# EasyEDA Pro project SBS-PCB.eprj

# Schematic Schematic1

## Sheets
1 BUCK: Board Name: Board1; Create Date: 2026-04-30; Page Name: BUCK; Project Name: SBS-PCB; Schematic Name: Schematic1; Update Date: 2026-05-18; Company: EasyEDA.com; Page Size: A4; Version: V1.0
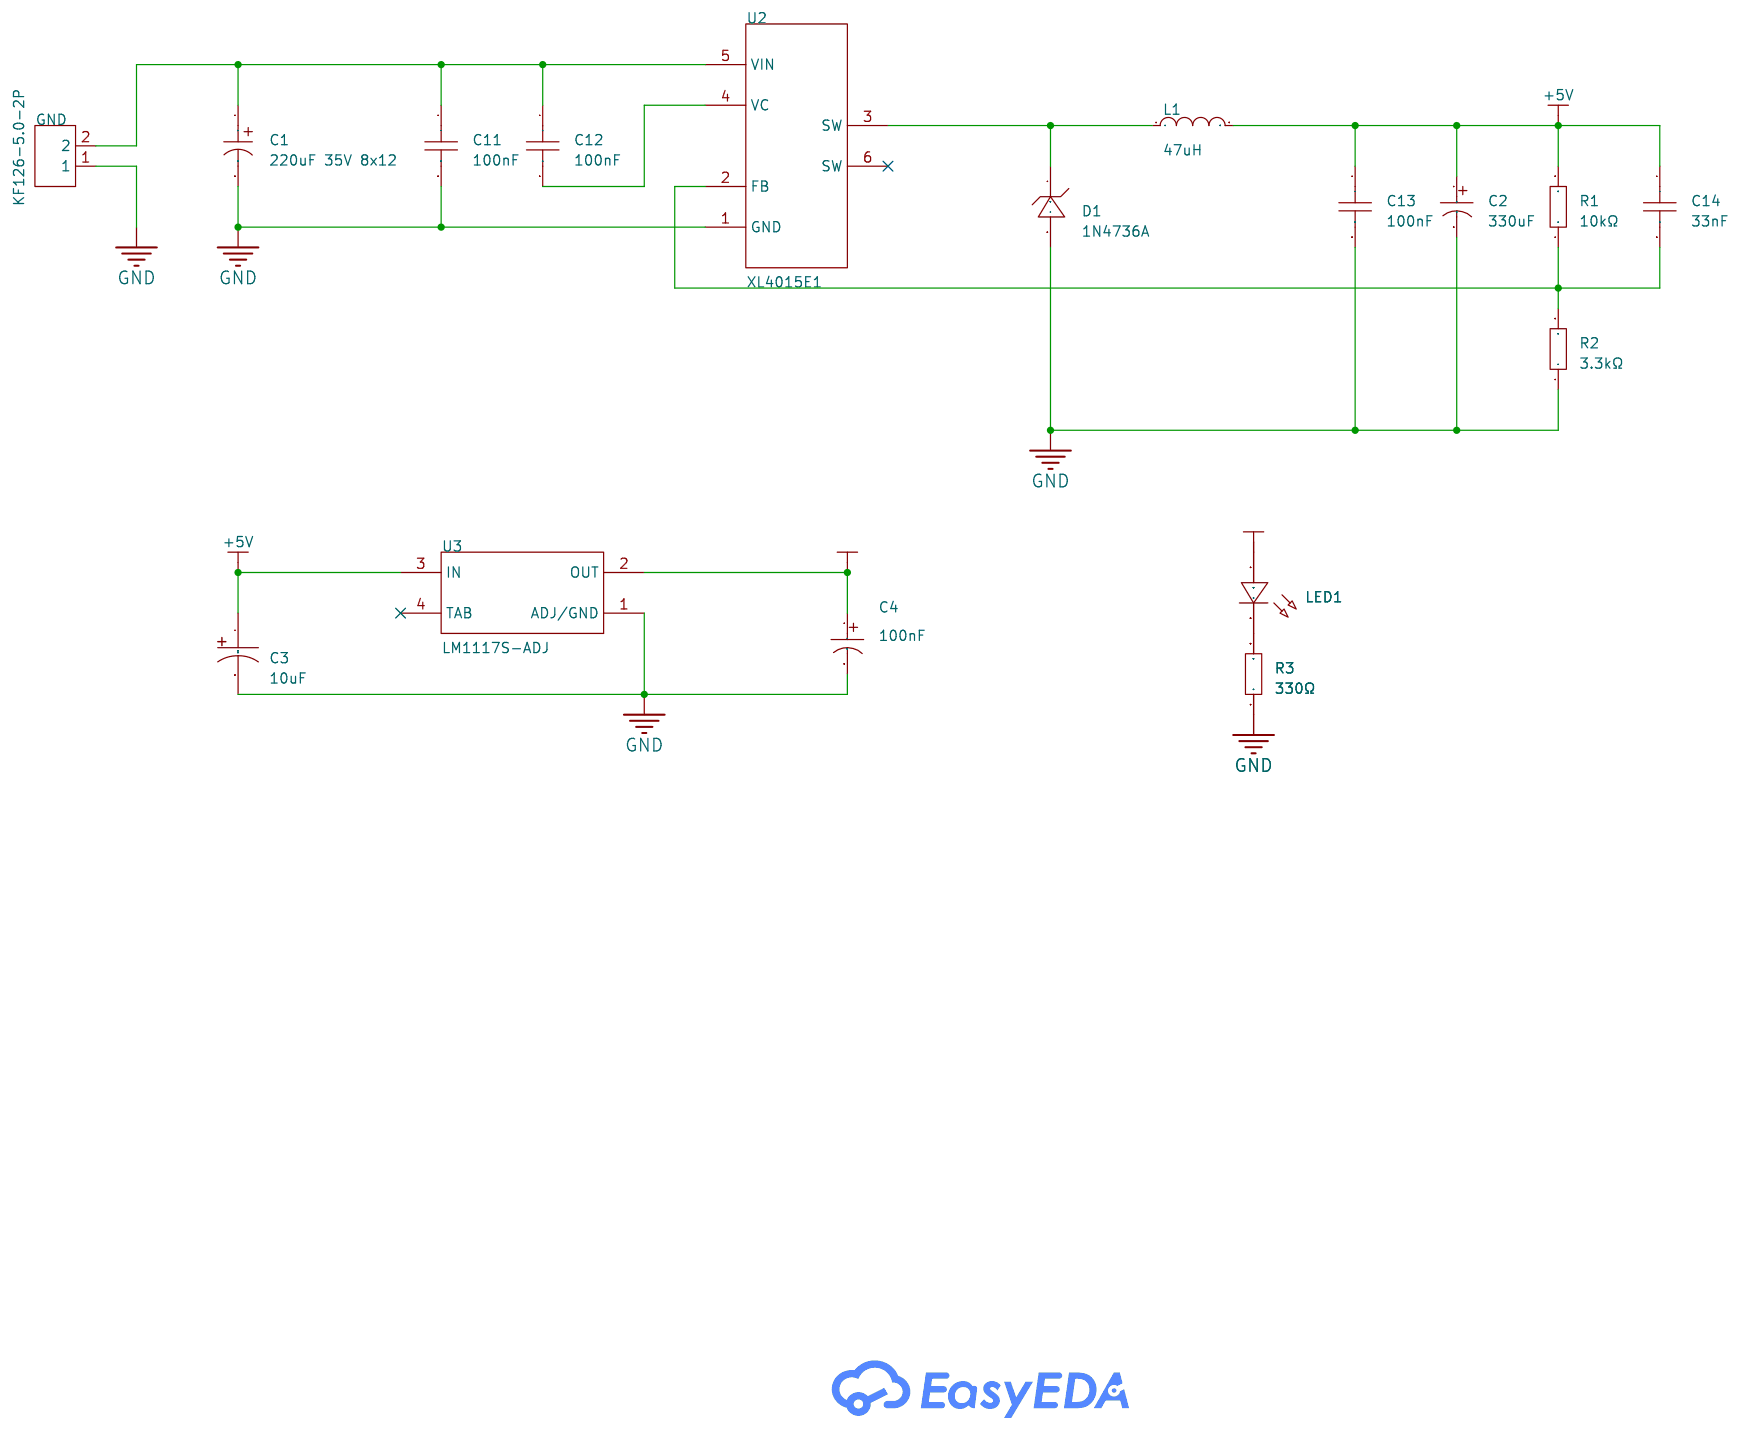
[diagram p0: BUCK]
2 VDK: Page Name: VDK; Update Date: 2026-05-08
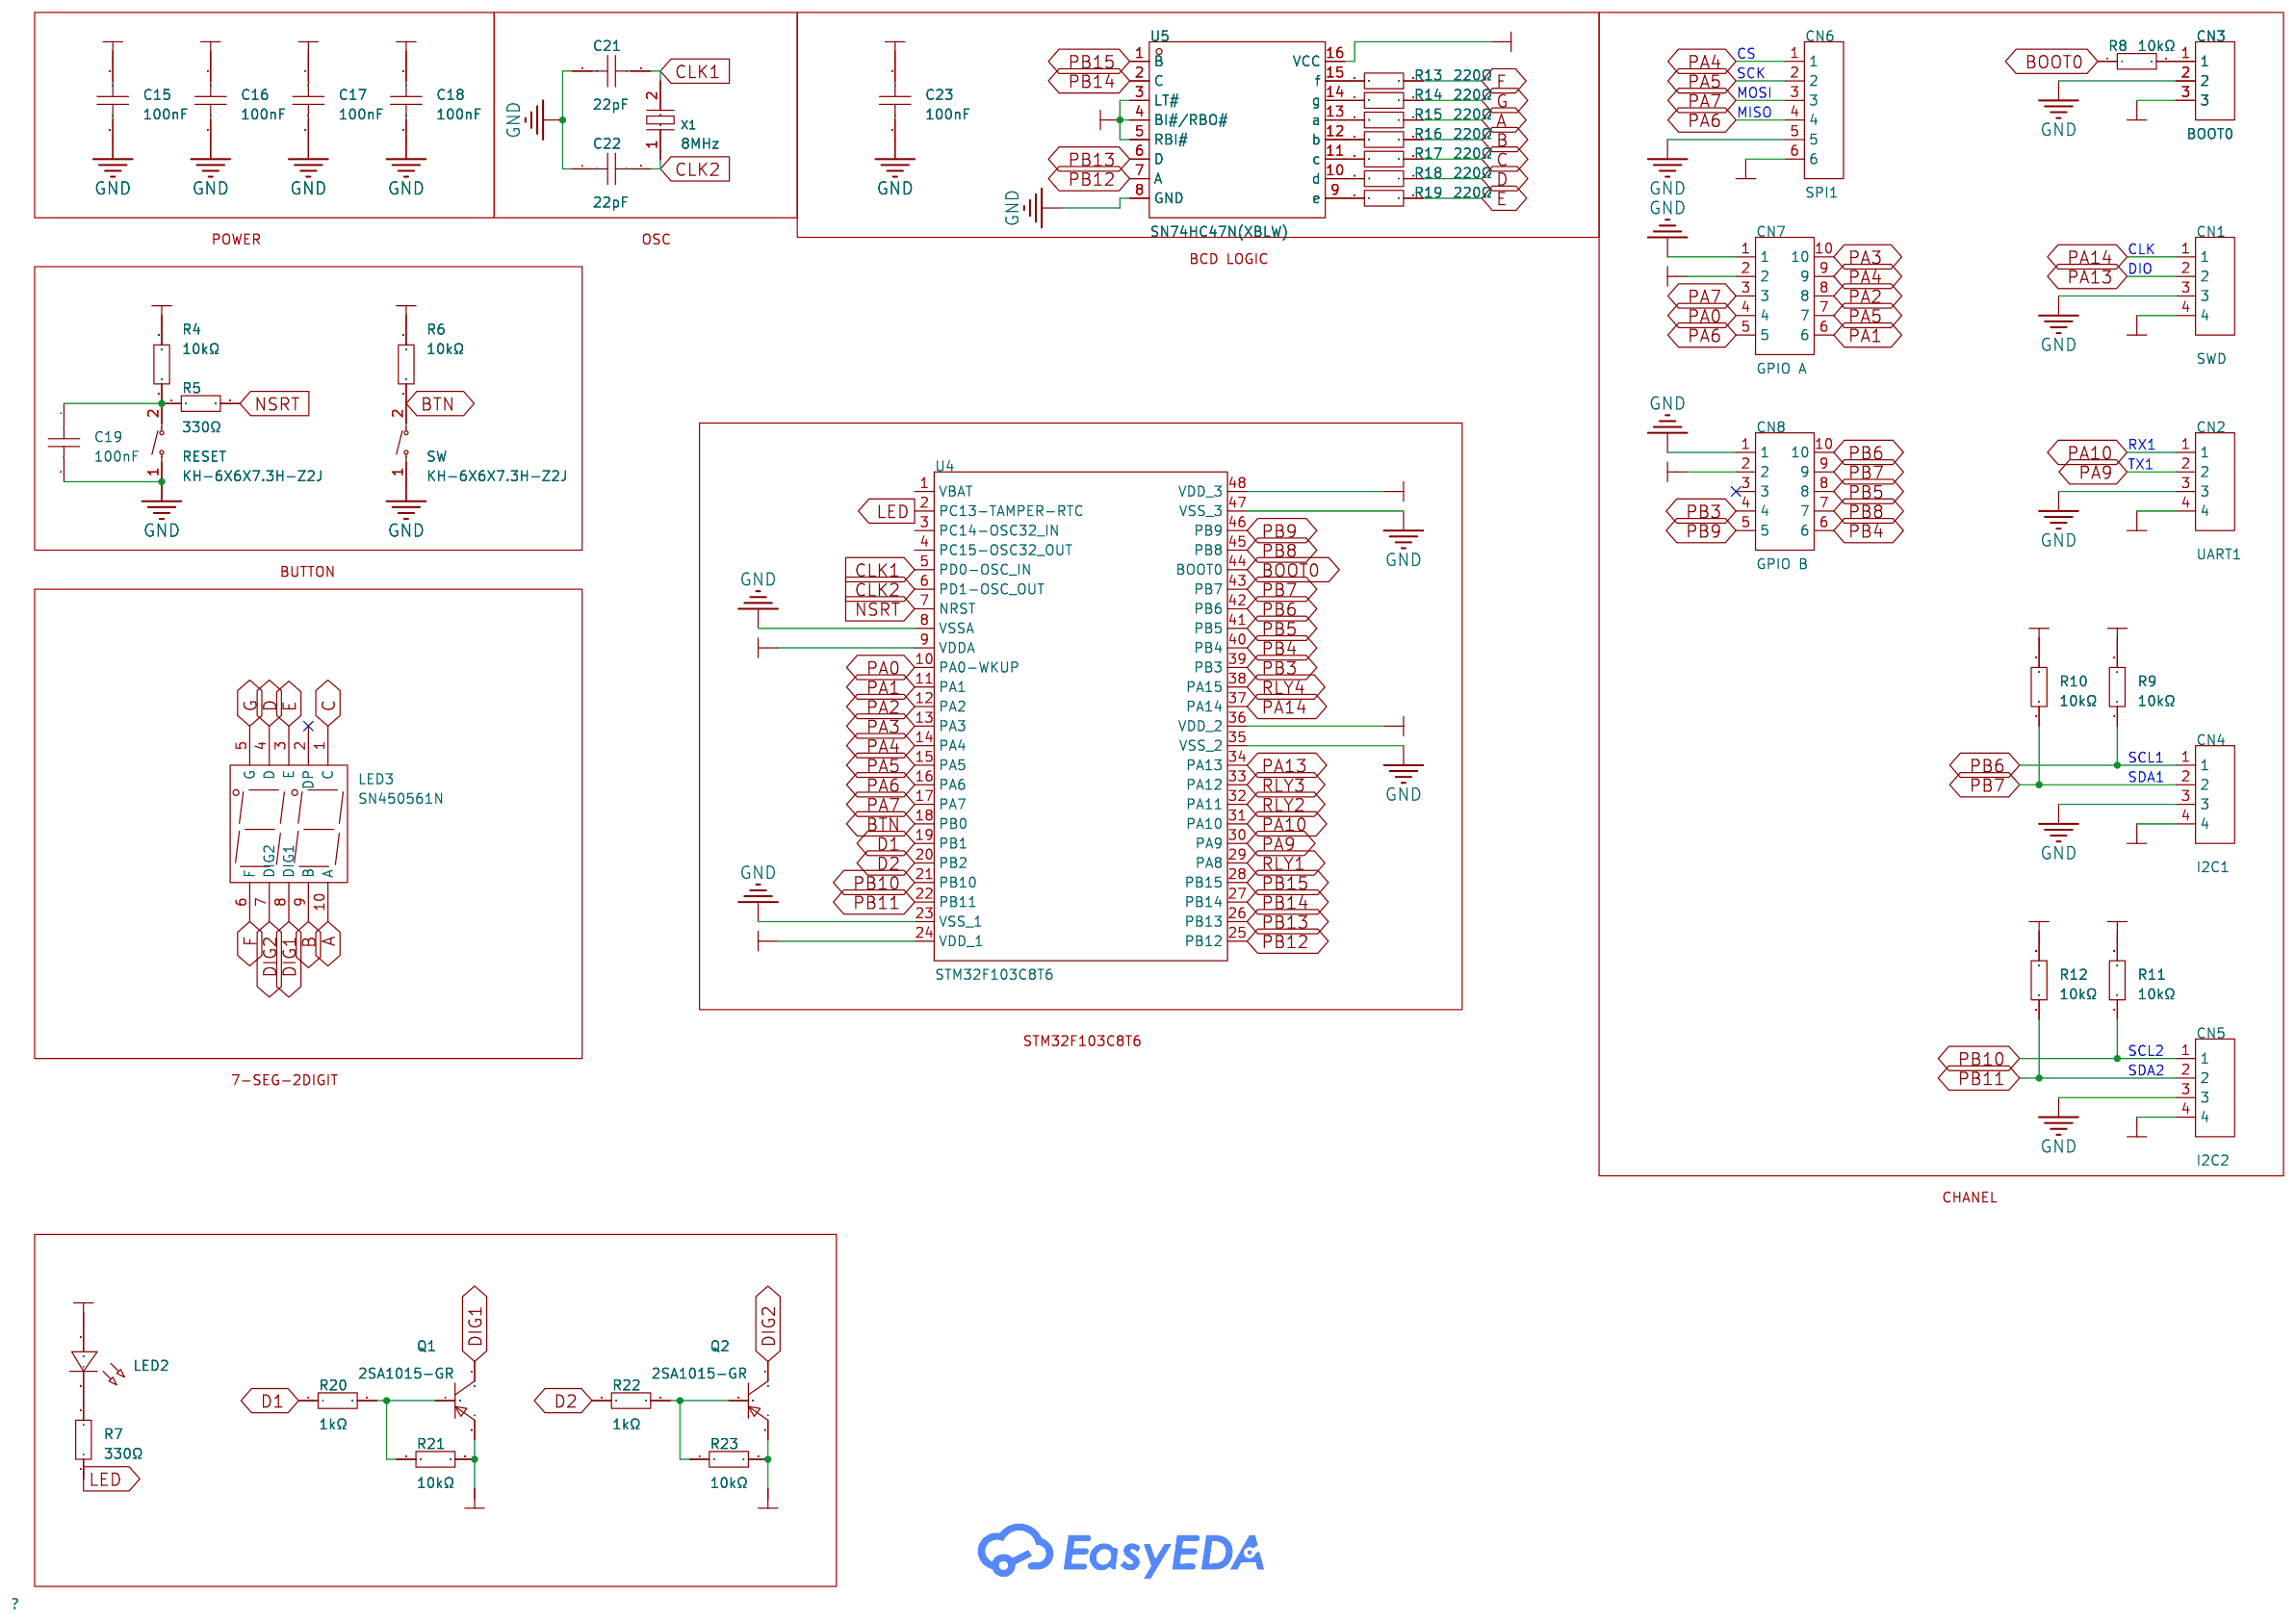
[diagram p1: VDK]
3 RELAY: Page Name: RELAY; Update Date: 2026-05-01
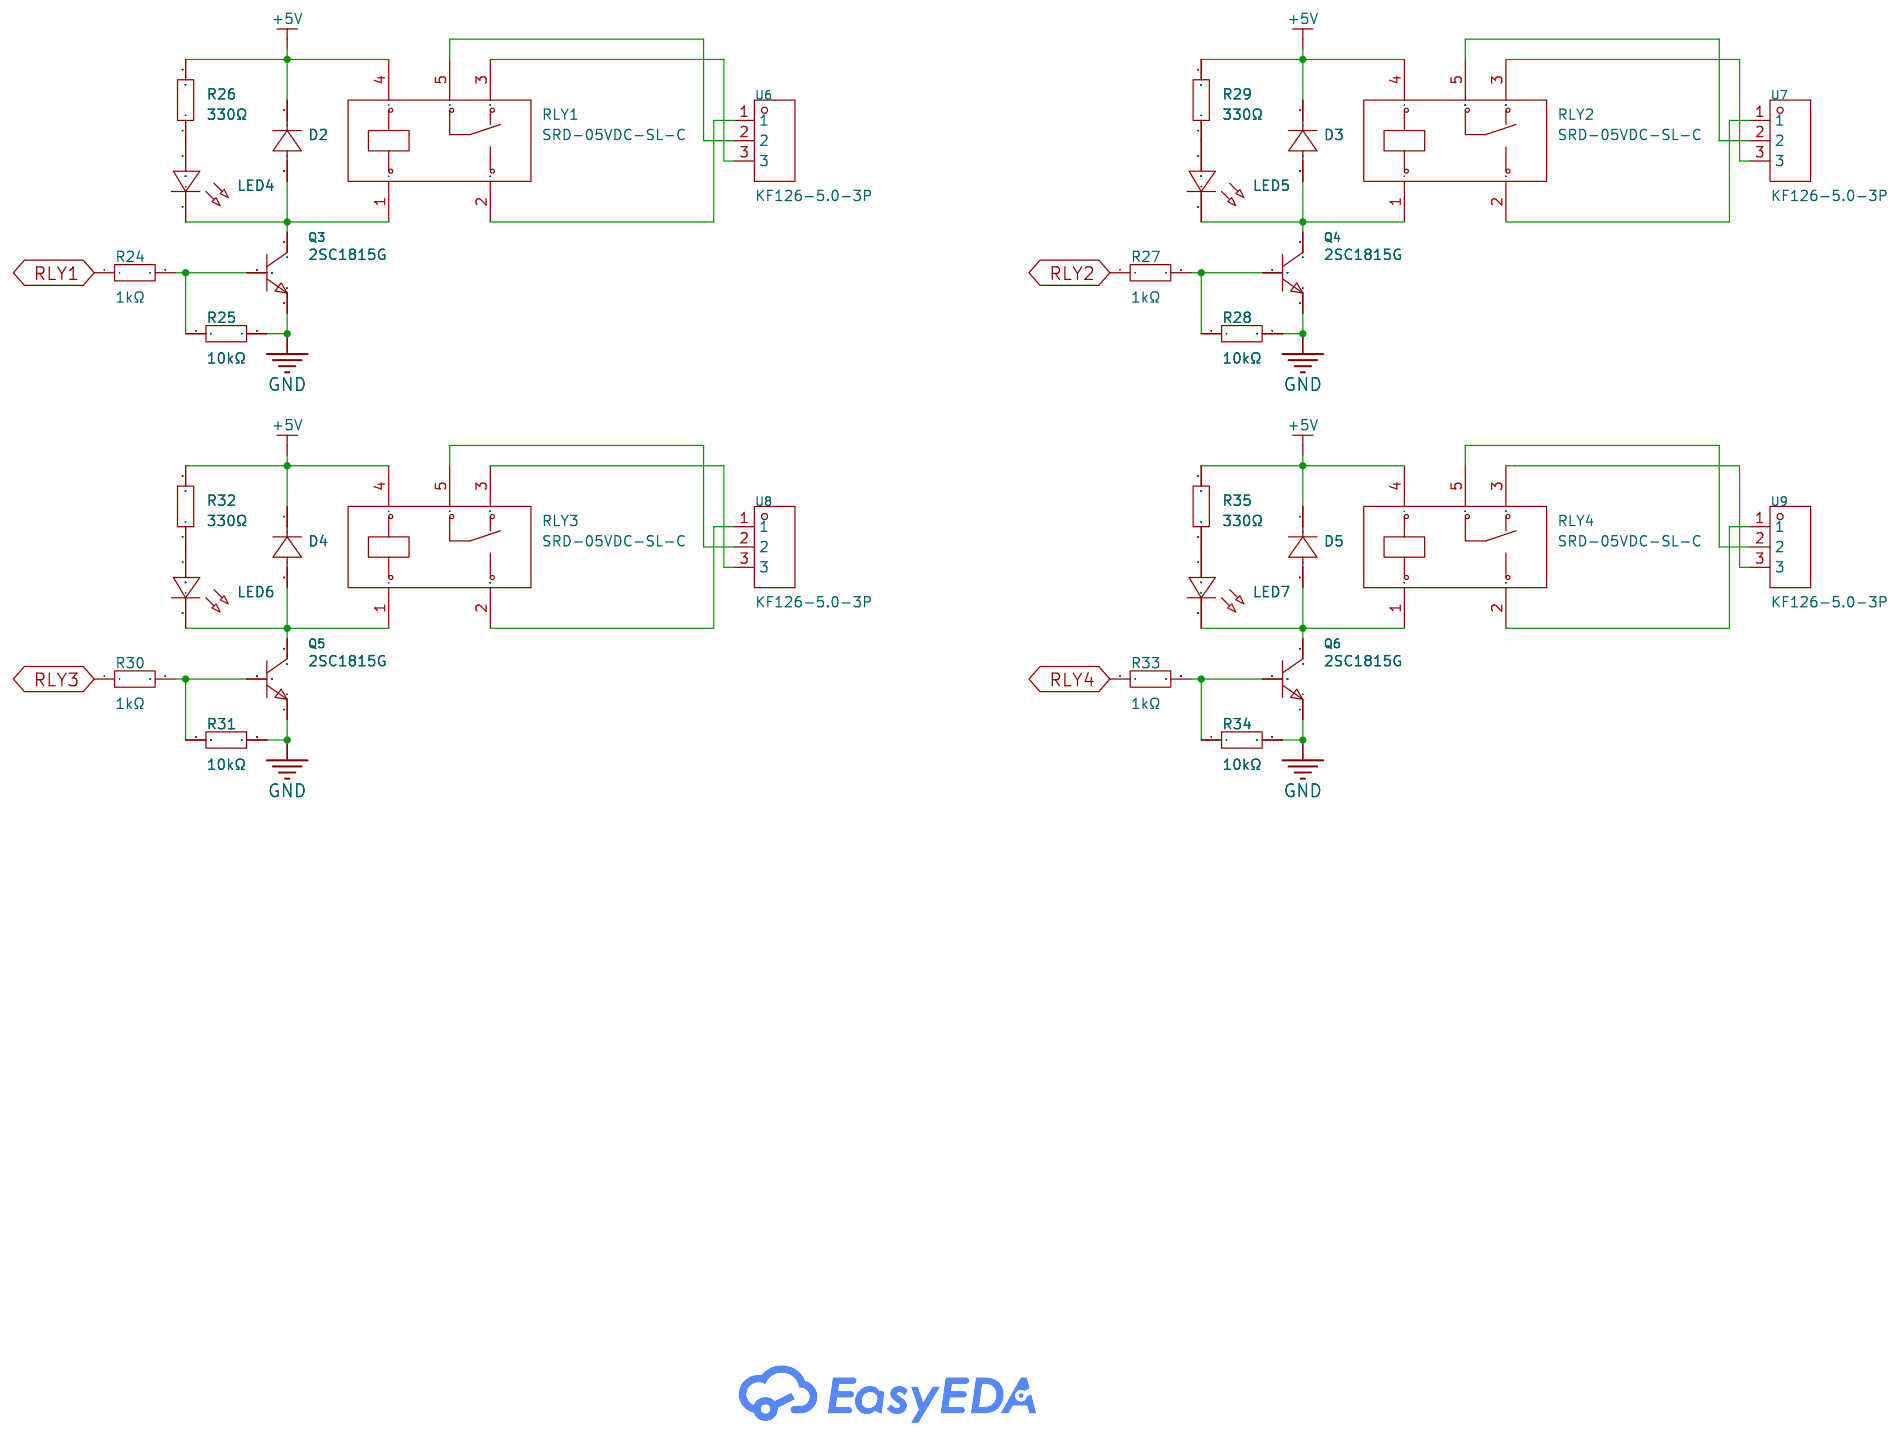
[diagram p2: RELAY]

## Parts
sheet BUCK
C1  220uF 35V 8x12  [CAP-TH_BD8.0-P3.50-D0.5-FD]
C2  330uF  [CAP-TH_BD8.0-P3.50-D0.6-FD]
C3  10uF  [CAP-TH_BD5.0-P2.00-D0.8-FD]
C4  100nF  [CAP-TH_BD5.0-P2.00-D0.8-FD]
C11  100nF  [CAP-TH_L5.0-W2.5-P5.00-D1.0]
C12  100nF  [CAP-TH_L5.0-W2.5-P5.00-D1.0]
C13  100nF  [CAP-TH_L5.0-W2.5-P5.00-D1.0]
C14  33nF  [CAP-TH_L5.0-W2.5-P5.00-D1.0]
D1  1N4736A  [DO-41_BD2.4-L4.7-P8.70-D0.9-RD]
GND  KF126-5.0-2P  [CONN-TH_P5.00_KF126-5.0-2P]
L1  47uH  [IND-TH_L14.5-W7.0-P7.0-D0.6_XR5026T470MVL7]
LED1  -  [LED_TH-3mm]
R1  10kΩ  [Res_1/4W]
R2  3.3kΩ  [Res_1/4W]
R3  330Ω  [Res_1/4W]
U2  XL4015E1  [TO-263-5_L10.2-W8.9-P1.70-TL]
U3  LM1117S-ADJ  [SOT-223-3_L6.5-W3.4-P2.30-LS7.0-BR]
sheet RELAY
D2  -  [DO-41_BD2.4-L4.7-P8.70-D0.9-RD]
D3  -  [DO-41_BD2.4-L4.7-P8.70-D0.9-RD]
D4  -  [DO-41_BD2.4-L4.7-P8.70-D0.9-RD]
D5  -  [DO-41_BD2.4-L4.7-P8.70-D0.9-RD]
LED4  -  [LED_TH-3mm]
LED5  -  [LED_TH-3mm]
LED6  -  [LED_TH-3mm]
LED7  -  [LED_TH-3mm]
Q3  2SC1815G  [TO-92-3_L5.1-W4.1-P1.27-L]
Q4  2SC1815G  [TO-92-3_L5.1-W4.1-P1.27-L]
Q5  2SC1815G  [TO-92-3_L5.1-W4.1-P1.27-L]
Q6  2SC1815G  [TO-92-3_L5.1-W4.1-P1.27-L]
R24  1kΩ  [Res_1/4W]
R25  10kΩ  [Res_1/4W]
R26  330Ω  [Res_1/4W]
R27  1kΩ  [Res_1/4W]
R28  10kΩ  [Res_1/4W]
R29  330Ω  [Res_1/4W]
R30  1kΩ  [Res_1/4W]
R31  10kΩ  [Res_1/4W]
R32  330Ω  [Res_1/4W]
R33  1kΩ  [Res_1/4W]
R34  10kΩ  [Res_1/4W]
R35  330Ω  [Res_1/4W]
RLY1  SRD-05VDC-SL-C  [RELAY-TH_SRD-XXVDC-XL-C]
RLY2  SRD-05VDC-SL-C  [RELAY-TH_SRD-XXVDC-XL-C]
RLY3  SRD-05VDC-SL-C  [RELAY-TH_SRD-XXVDC-XL-C]
RLY4  SRD-05VDC-SL-C  [RELAY-TH_SRD-XXVDC-XL-C]
U6  KF126-5.0-3P  [CONN-TH_3P-P5.00_KF126-5.0-3P]
U7  KF126-5.0-3P  [CONN-TH_3P-P5.00_KF126-5.0-3P]
U8  KF126-5.0-3P  [CONN-TH_3P-P5.00_KF126-5.0-3P]
U9  KF126-5.0-3P  [CONN-TH_3P-P5.00_KF126-5.0-3P]
sheet VDK
C15  100nF  [CAP-TH_L5.0-W2.5-P5.00-D1.0]
C16  100nF  [CAP-TH_L5.0-W2.5-P5.00-D1.0]
C17  100nF  [CAP-TH_L5.0-W2.5-P5.00-D1.0]
C18  100nF  [CAP-TH_L5.0-W2.5-P5.00-D1.0]
C19  100nF  [CAP-TH_L5.0-W2.5-P5.00-D1.0]
C21  22pF  [CAP-TH_L5.0-W2.5-P5.00-D1.0]
C22  22pF  [CAP-TH_L5.0-W2.5-P5.00-D1.0]
C23  100nF  [CAP-TH_L5.0-W2.5-P5.00-D1.0]
CN1  SWD  [CONN-TH_4P-P2.54-XH2.54-LI-4P]
CN2  UART1  [CONN-TH_4P-P2.54-XH2.54-LI-4P]
CN3  BOOT0  [CONN-TH_3P-P2.50_3PIN]
CN4  I2C1  [CONN-TH_4P-P2.54-XH2.54-LI-4P]
CN5  I2C2  [CONN-TH_4P-P2.54-XH2.54-LI-4P]
CN6  SPI1  [CONN-TH_XH2.54-6P]
CN7  GPIO A  [HDR-TH_10P-P2.54-V-M-R2-C5-S2.54]
CN8  GPIO B  [HDR-TH_10P-P2.54-V-M-R2-C5-S2.54]
LED2  -  [LED_TH-3mm]
LED3  SN450561N  [LED-SEG-TH_10P-L25.0-W19.0-P2.54-S15.24-BL]
Q1  2SA1015-GR  [TO-92-3_L4.9-W3.7-P1.27-R]
Q2  2SA1015-GR  [TO-92-3_L4.9-W3.7-P1.27-R]
R4  10kΩ  [Res_1/4W]
R5  330Ω  [Res_1/4W]
R6  10kΩ  [Res_1/4W]
R7  330Ω  [Res_1/4W]
R8  10kΩ  [Res_1/4W]
R9  10kΩ  [Res_1/4W]
R10  10kΩ  [Res_1/4W]
R11  10kΩ  [Res_1/4W]
R12  10kΩ  [Res_1/4W]
R13  220Ω  [Res_1/4W]
R14  220Ω  [Res_1/4W]
R15  220Ω  [Res_1/4W]
R16  220Ω  [Res_1/4W]
R17  220Ω  [Res_1/4W]
R18  220Ω  [Res_1/4W]
R19  220Ω  [Res_1/4W]
R20  1kΩ  [Res_1/4W]
R21  10kΩ  [Res_1/4W]
R22  1kΩ  [Res_1/4W]
R23  10kΩ  [Res_1/4W]
RESET  KH-6X6X7.3H-Z2J  [KEY-TH_L6.2-W6.2-P5.00]
SW  KH-6X6X7.3H-Z2J  [KEY-TH_L6.2-W6.2-P5.00]
U4  STM32F103C8T6  [LQFP-48_L7.0-W7.0-P0.50-LS9.0-BL]
U5  SN74HC47N(XBLW)  [PDIP-16_L19.3-W6.4-P2.54-LS7.94-BL]
X1  8MHz  [HC-49US_L11.0-W4.6-P4.88]

## Library data of the parts
C1 = 220uF35V8x12KM: LCSC Part Name: 220uF ±20% 35V; Supplier Part: C49304872; Manufacturer: Econd(米朗电子); Supplier Footprint: 插件,D8xL12mm; JLCPCB Part Class: Extended Part; Datasheet: https://item.szlcsc.com/datasheet/220uF35V8x12KM/51766700.html; Supplier: LCSC; Tolerance: ±20%; Voltage Rating: 35V; Ripple Current: 300mA@120Hz; Pin Spacing: 3.5mm; Diameter: 8mm; Height - Seated (Max): 12mm; Lifetime: 2000hrs@105℃; Operating Temperature: -40℃~+105℃
C2 = 330uF 25V 8*12: LCSC Part Name: 330uF 25V; Supplier Part: C44590; Supplier Footprint: 插件,8x12mm; JLCPCB Part Class: Extended Part; Supplier: LCSC
C3 = NXA50VB10M5*11_LO: LCSC Part Name: 10uF 50V; Supplier Part: C346966; Supplier Footprint: 插件,5x11mm; JLCPCB Part Class: Extended Part; Supplier: LCSC
C4 = 0.1uF 50V 5*11: LCSC Part Name: 100nF 50V; Supplier Part: C45091; Supplier Footprint: 插件,5x11mm; JLCPCB Part Class: Extended Part; Supplier: LCSC
C11-C19 C21-C23 = 100nF: Supplier Part: C9900015256; JLCPCB Part Class: Extended Part; Supplier: LCSC
D1 = 1N4736A_C261309: Supplier Part: C261309; Manufacturer: TC(德昌); Supplier Footprint: DO-41; JLCPCB Part Class: Extended Part; Datasheet: https://item.szlcsc.com/datasheet/1N4736A/253022.html; Supplier: LCSC; Diode Configuration: Independent; Zener Voltage(Nom): 6.8V; Reverse Leakage Current (Ir): 10uA@4V; Zener Voltage(Range): 6.46V~7.14V; Pd - Power Dissipation: 1W; Impedance(Zzt): 3.5Ω; Impedance(Zzk): 700Ω; Operating Junction Temperature Range: -65℃~+200℃
GND = KF126-5.0-2P: LCSC Part Name: 1x2P 5mm 直插 排数:1 每排P数:2; Supplier Part: C474900; Manufacturer: KEFA(科发); Supplier Footprint: 插件,P=5mm; JLCPCB Part Class: Extended Part; Datasheet: https://item.szlcsc.com/datasheet/KF126-5.0-2P/481518.html; Supplier: LCSC; Number of Positions or Pins: 1x2P; Pitch: 5mm; Color: Green; Mounting Type: Through Hole; Number of Pins: 2P; Number of Rows: 1; Number of PINs Per Row: 2; Current Rating: 18A; Voltage Rating (Max): 250V; Wire Gauge - AWG: 14~26; Wire Gauge - mm2: 2.5; Operating Temperature: -40℃~+105℃
L1 = XR5026T470MVL7: LCSC Part Name: 裸体磁环体积、材质、导感率等参数; Supplier Part: C22358330; Manufacturer: XR(祥如); Supplier Footprint: 插件,D=14.5mm; JLCPCB Part Class: Extended Part; Datasheet: https://item.szlcsc.com/datasheet/XR5026T470MVL7/23794669.html; Supplier: LCSC; Tolerance: ±10%; Current Rating: 4A; Type: Toroidal Inductor; Wire Diameter: 0.7mm
LED1 LED2 = LED_TH-R_3mm: Supplier Footprint: 插件
R1-R35 = Res_AXIAL-1/4W: Supplier Footprint: 轴向引线
U2 = XL4015E1: LCSC Part Name: 5A 180KHz 36V 降压型DC-DC转换器; Supplier Part: C51661; Manufacturer: XLSEMI(芯龙); Supplier Footprint: TO-263-5; Datasheet: https://item.szlcsc.com/datasheet/XL4015E1/52674.html; Supplier: LCSC; Function: Buck; Voltage - Supply: 8V~36V; Output Voltage: 1.25V~32V; Output Current: 5A; Frequency - Switching: 180kHz; Operating Temperature: -40℃~+125℃; Synchronous Rectifier: No; Number of Outputs: 1; Topology: Buck; Quiescent Current: 5mA; Switch tube (built-in/external): Built-in; Output Type: Adjustable
U3 = LM1117S-ADJ: LCSC Part Name: 1A低压差线性稳压器; Supplier Part: C126029; Manufacturer: HTC; Supplier Footprint: SOT-223; JLCPCB Part Class: Extended Part; Datasheet: https://item.szlcsc.com/datasheet/LM1117S-ADJ/137309.html; Supplier: LCSC; Output Type: Adjustable; Voltage - Supply: 12V; Output Voltage: 1.238V~1.281V; Output Current: 1A; Power Supply Rejection Ratio (PSRR): 75dB@(120Hz); Voltage Dropout: 1.2V@(1A); Features: Over Temperature Protection; Operating Temperature: -40℃~+125℃@(Tj); Output Configuration: Positive; Number of Outputs: 1
D2-D5 = 1N4007: Supplier Footprint: DO-41
LED4-LED7 = LED_TH-G_3mm: Supplier Footprint: 插件
Q3-Q6 = 2SC1815G: LCSC Part Name: hfe=200~400 NPN 电流:150mA 电压:50V; Supplier Part: C118545; Manufacturer: ST(先科); Supplier Footprint: TO-92; JLCPCB Part Class: Extended Part; Datasheet: https://item.szlcsc.com/datasheet/2SC1815G/119812.html; Supplier: LCSC; type: NPN; Current - Collector(Ic): 150mA; Collector - Emitter Voltage VCEO: 50V; Pd - Power Dissipation: 400mW; DC Current Gain: 200@2mA,6V; Transition frequency(fT): 80MHz; Current - Collector Cutoff: 100nA; Vce Saturation(VCE(sat)): 250mV@100mA,10mA; Emitter-Base Voltage(Vebo): 5V; Number: 1 NPN
RLY1-RLY4 = SRD-05VDC-SL-C: LCSC Part Name: 蓝色 单组转换型继电器; Supplier Part: C35449; Manufacturer: 松乐; Supplier Footprint: 插件,19.2x15.6mm; JLCPCB Part Class: Extended Part; Datasheet: https://item.szlcsc.com/datasheet/SRD-05VDC-SL-C/36422.html; Supplier: LCSC; Coil Voltage: 5V; Contact Form: One set changeover: 1C (SPDT - changeover); Number of Pins: 5; Switching Voltage(Max): 250V@AC; Coil Rated Power: 360mW; Switching Current(Max): 15A; Coil Type: Non-Polarized - Single Coil; Coil Resistance: 70Ω; Contact Resistance: 100mΩ; Operate Time: 10ms; Release Time: 10ms
U6-U9 = KF126-5.0-3P: LCSC Part Name: 1x3P 5mm 直插 排数:1 每排P数:3; Supplier Part: C474901; Manufacturer: KEFA(科发); Supplier Footprint: 插件,P=5mm; JLCPCB Part Class: Extended Part; Datasheet: https://item.szlcsc.com/datasheet/KF126-5.0-3P/481519.html; Supplier: LCSC; Number of Positions or Pins: 1x3P; Pitch: 5mm; Color: Green; Mounting Type: Through Hole; Number of Pins: 3P; Number of Rows: 1; Number of PINs Per Row: 3; Current Rating: 18A; Voltage Rating (Max): 250V; Wire Gauge - AWG: 14~26; Wire Gauge - mm2: 2.5; Operating Temperature: -40℃~+105℃
CN1 CN2 CN4 CN5 = XHB2.54-4P: Supplier Part: C9900014704; JLCPCB Part Class: Extended Part; Supplier: LCSC
CN3 = 3PIN白色直针插座: Supplier Part: C9900004958; Supplier Footprint: XH2.54MM; JLCPCB Part Class: Extended Part; Supplier: LCSC
CN6 = XH2.54*6P_直插: Supplier Part: C9900008614; Supplier Footprint: XH2.54_6P; JLCPCB Part Class: Extended Part; Supplier: LCSC
CN7 CN8 = Header-Female-2.54_2x5: Supplier Part: C9900010884; JLCPCB Part Class: Extended Part; Supplier: LCSC
LED3 = SN450561N: LCSC Part Name: 2位0.56英寸红色数码管 共阳极; Supplier Part: C193143; Manufacturer: ARKLED(方舟); Supplier Footprint: 插件; JLCPCB Part Class: Extended Part; Datasheet: https://item.szlcsc.com/datasheet/SN450561N/226348.html; Supplier: LCSC; Number of Characters: 2; Digit/Alpha Size(inch): 0.56; Illumination Color: Red; LED Polarity: Common Anode
Q1 Q2 = 2SA1015-GR: Supplier Part: C2844068; Manufacturer: BLUE ROCKET(蓝箭); Supplier Footprint: TO-92-3; JLCPCB Part Class: Extended Part; Datasheet: https://atta.szlcsc.com/upload/public/pdf/source/20210712/C2844068_C347052EB3F495032D45BAB891BF061D.pdf; Supplier: LCSC; type: PNP; Pd - Power Dissipation: 400mW; Current - Collector Cutoff: 100nA
RESET SW = KH-6X6X7.3H-Z2J: LCSC Part Name: 6.2mm*6.2mm*7.3mm 12V 50mA; Supplier Part: C22392358; Manufacturer: kinghelm(金航标); Supplier Footprint: 插件,6.2x6.2mm; JLCPCB Part Class: Extended Part; Datasheet: https://item.szlcsc.com/datasheet/KH-6X6X7.3H-Z2J/23979044.html; Supplier: LCSC; Circuit: SPST; Actuator Style: Round Button; Mounting Type: Through Hole; Length: 6.2mm; Width: 6.2mm; Switch Height: 7.3mm; with Bracket: Without Bracket; Contact Current: 50mA; Voltage Rating: 12V; With Lamp: No; Termination Style: PC Pin; Operating Temperature: -20℃~+70℃
U4 = STM32F103C8T6: LCSC Part Name: 主流增强型ARM Cortex-M3 MCU，具有64 KB Flash、72 MHz CPU、电机控制、USB和CAN; Supplier Part: C8734; Manufacturer: ST(意法半导体); Supplier Footprint: LQFP-48(7x7); JLCPCB Part Class: Extended Part; Datasheet: https://item.szlcsc.com/datasheet/STM32F103C8T6/9243.html; Supplier: LCSC; CPU Core: ARM-M3; CPU Maximum Speed: 72MHz; Program Storage Size: 64KB; Program Memory Type: FLASH; Number of I/O: 37; ADC (Bit): 12bit; Voltage - Supply: 2V~3.6V
U5 = SN74HC47N(XBLW): Supplier Part: C19708132; Manufacturer: XBLW(芯伯乐); Supplier Footprint: DIP-16; JLCPCB Part Class: Extended Part; Datasheet: https://item.szlcsc.com/datasheet/SN74HC47N(XBLW)/21016175.html; Supplier: LCSC; Voltage - Input(DC): 2V~6V; Number of Channels: 7; Output Current: 25mA; Operating temperature: -40℃~+125℃
X1 = ATS080C: LCSC Part Name: 8MHz ±30ppm 32pF; Supplier Part: C1669722; Manufacturer: CTS(西迪斯); Supplier Footprint: HC-49S; JLCPCB Part Class: Extended Part; Datasheet: https://atta.szlcsc.com/upload/public/pdf/source/20220124/B9986DAB42ECDE31CA8A9C6A4A6F535C.pdf; Supplier: LCSC; Normal temperature Frequency Tolerance: ±30ppm; External load capacitor: 32pF; Frequency Stability(Full temperature range): ±50ppm; Equivalent Series Resistance (ESR): 60Ω

## Nets
+3.3V: C4.1 C15.1 C16.1 C17.1 C18.1 C23.1 CN1.4 CN2.4 CN3.3 CN4.4 CN5.4 CN6.6 CN7.2 CN8.2 LED1.1(C) LED2.1(C) Q1.3(E) Q2.3(E) R4.2 R6.2 R9.2 R10.2 R11.2 R12.2 R21.2 R23.2 U3.2(OUT) U4.9(VDDA) U4.24(VDD_1) U4.36(VDD_2) U4.48(VDD_3) U5.3(LT#) U5.4(BI#/RBO#) U5.5(RBI#) U5.16(VCC)
+5V: C2.1 C3.1 C13.1 C14.1 D2.1(K) D3.1(K) D4.1(K) D5.1(K) L1.2 R1.2 R26.2 R29.2 R32.2 R35.2 RLY1.4 RLY2.4 RLY3.4 RLY4.4 U3.3(IN)
GND: C1.2 C2.2 C3.2 C4.2 C11.2 C13.2 C15.2 C16.2 C17.2 C18.2 C19.2 C21.1 C22.1 C23.2 CN1.3 CN2.3 CN3.2 CN4.3 CN5.3 CN6.5 CN7.1 CN8.1 D1.2(A) GND.1 Q3.1(E) Q4.1(E) Q5.1(E) Q6.1(E) R2.1 R3.1 R25.2 R28.2 R31.2 R34.2 RESET.1 SW.1 U2.1(GND) U3.1(ADJ/GND) U4.8(VSSA) U4.23(VSS_1) U4.35(VSS_2) U4.47(VSS_3) U5.8(GND)
A: LED3.10(A) R15.1
B: LED3.9(B) R16.1
BOOT0: R8.1 U4.44(BOOT0)
BTN: R6.1 SW.2 U4.18(PB0)
C: LED3.1(C) R17.1
CLK1: C21.2 U4.5(PD0-OSC_IN) X1.2
CLK2: C22.2 U4.6(PD1-OSC_OUT) X1.1
D: LED3.4(D) R18.1
D1: R20.1 U4.19(PB1)
D2: R22.1 U4.20(PB2)
DIG1: LED3.8(DIG1) Q1.2(C)
DIG2: LED3.7(DIG2) Q2.2(C)
E: LED3.3(E) R19.1
F: LED3.6(F) R13.1
G: LED3.5(G) R14.1
LED: LED2.2(A) R7.1 R7.2 U4.2(PC13-TAMPER-RTC)
NSRT: R5.2 U4.7(NRST)
PA0: CN7.4 U4.10(PA0-WKUP)
PA1: CN7.6 U4.11(PA1)
PA2: CN7.8 U4.12(PA2)
PA3: CN7.10 U4.13(PA3)
PA4: CN6.1 CN7.9 U4.14(PA4)
PA5: CN6.2 CN7.7 U4.15(PA5)
PA6: CN6.4 CN7.5 U4.16(PA6)
PA7: CN6.3 CN7.3 U4.17(PA7)
PA9: CN2.2 U4.30(PA9)
PA10: CN2.1 U4.31(PA10)
PA13: CN1.2 U4.34(PA13)
PA14: CN1.1 U4.37(PA14)
PB3: CN8.4 U4.39(PB3)
PB4: CN8.6 U4.40(PB4)
PB5: CN8.8 U4.41(PB5)
PB6: CN4.1 CN8.10 R9.1 U4.42(PB6)
PB7: CN4.2 CN8.9 R10.1 U4.43(PB7)
PB8: CN8.7 U4.45(PB8)
PB9: CN8.5 U4.46(PB9)
PB10: CN5.1 R11.1 U4.21(PB10)
PB11: CN5.2 R12.1 U4.22(PB11)
PB12: U4.25(PB12) U5.7(A)
PB13: U4.26(PB13) U5.6(D)
PB14: U4.27(PB14) U5.2(C)
PB15: U4.28(PB15) U5.1(B)
RLY1: R24.1 U4.29(PA8)
RLY2: R27.1 U4.32(PA11)
RLY3: R30.1 U4.33(PA12)
RLY4: R33.1 U4.38(PA15)
$1N1678: C1.1 C11.1 C12.1 GND.2 U2.5(VIN)
$1N1723: C12.2 U2.4(VC)
$1N1863: D1.1(C) L1.1 U2.3(SW)
$1N1929: C14.2 R1.1 R2.2 U2.2(FB)
$1N2031: LED1.2(A) R3.2
$2N1835: C19.1 R4.1 R5.1 RESET.2
$2N3059: CN3.1 R8.2
$2N7394: R13.2 U5.15(f)
$2N7423: R14.2 U5.14(g)
$2N7454: R15.2 U5.13(a)
$2N7483: R16.2 U5.12(b)
$2N7512: R17.2 U5.11(c)
$2N7541: R18.2 U5.10(d)
$2N7570: R19.2 U5.9(e)
$2N7812: Q1.1(B) R20.2 R21.1
$2N8088: Q2.1(B) R22.2 R23.1
$3N247: Q3.3(B) R24.2 R25.1
$3N338: D2.2(A) LED4.2(A) Q3.2(C) RLY1.1
$3N597: RLY1.2 U6.1
$3N1771: RLY1.5 U6.2
$3N1927: RLY1.3 U6.3
$3N4941: LED4.1(C) R26.1
$3N5260: Q4.3(B) R27.2 R28.1
$3N5264: D3.2(A) LED5.2(A) Q4.2(C) RLY2.1
$3N5265: RLY2.5 U7.2
$3N5266: RLY2.2 U7.1
$3N5267: RLY2.3 U7.3
$3N5269: LED5.1(C) R29.1
$3N5860: RLY3.5 U8.2
$3N5861: RLY3.2 U8.1
$3N5862: RLY3.3 U8.3
$3N5863: D4.2(A) LED6.2(A) Q5.2(C) RLY3.1
$3N5864: LED6.1(C) R32.1
$3N5866: D5.2(A) LED7.2(A) Q6.2(C) RLY4.1
$3N5867: LED7.1(C) R35.1
$3N5871: Q5.3(B) R30.2 R31.1
$3N5875: RLY4.5 U9.2
$3N5876: RLY4.2 U9.1
$3N5877: RLY4.3 U9.3
$3N5878: Q6.3(B) R33.2 R34.1

Not connected (* = marked no-connect by the designer): CN8 3*; LED3 2(DP)*; U2 6(SW)*; U3 4(TAB)*; U4 1(VBAT) 3(PC14-OSC32_IN) 4(PC15-OSC32_OUT)

## Notes on the sheets
sheet 2
- CS
- SCK
- MOSI
- MISO
- POWER
- OSC
- BCD LOGIC
- CLK
- DIO
- RX1
- TX1
- BUTTON
- SCL1
- SDA1
- STM32F103C8T6
- SCL2
- SDA2
- 7-SEG-2DIGIT
- CHANEL

# Board PCB1
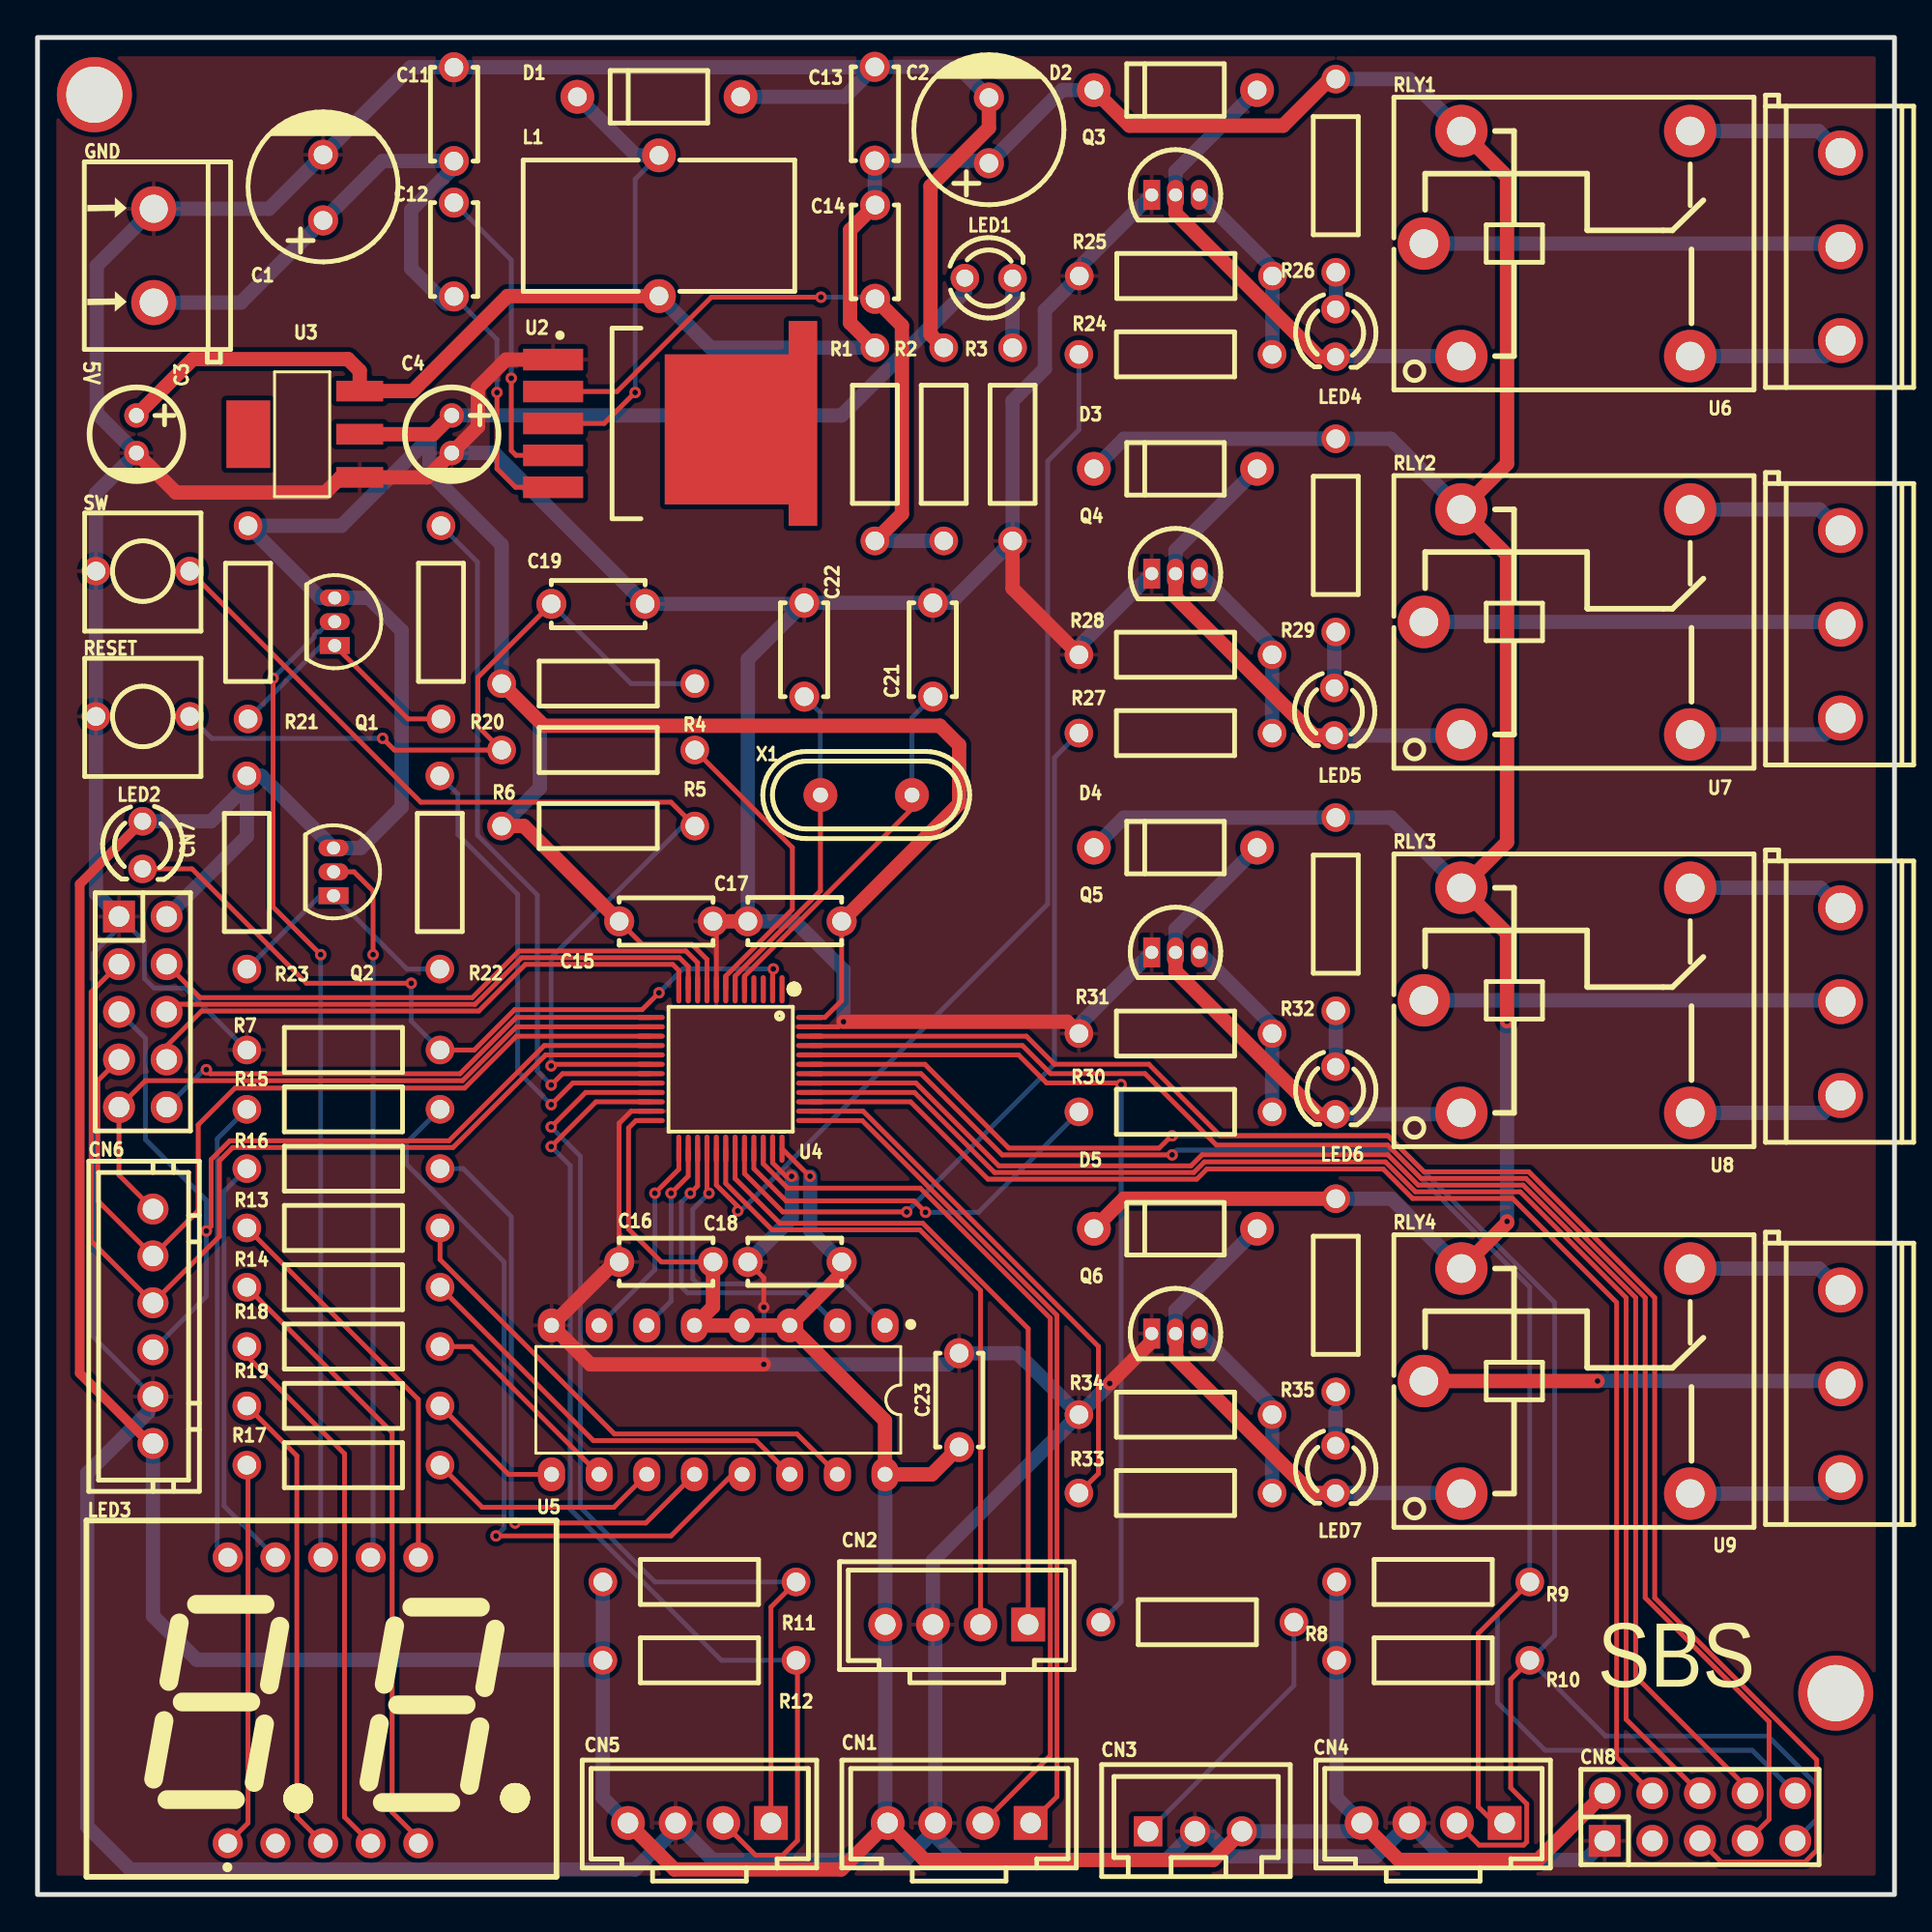
[diagram p3: board, top side]
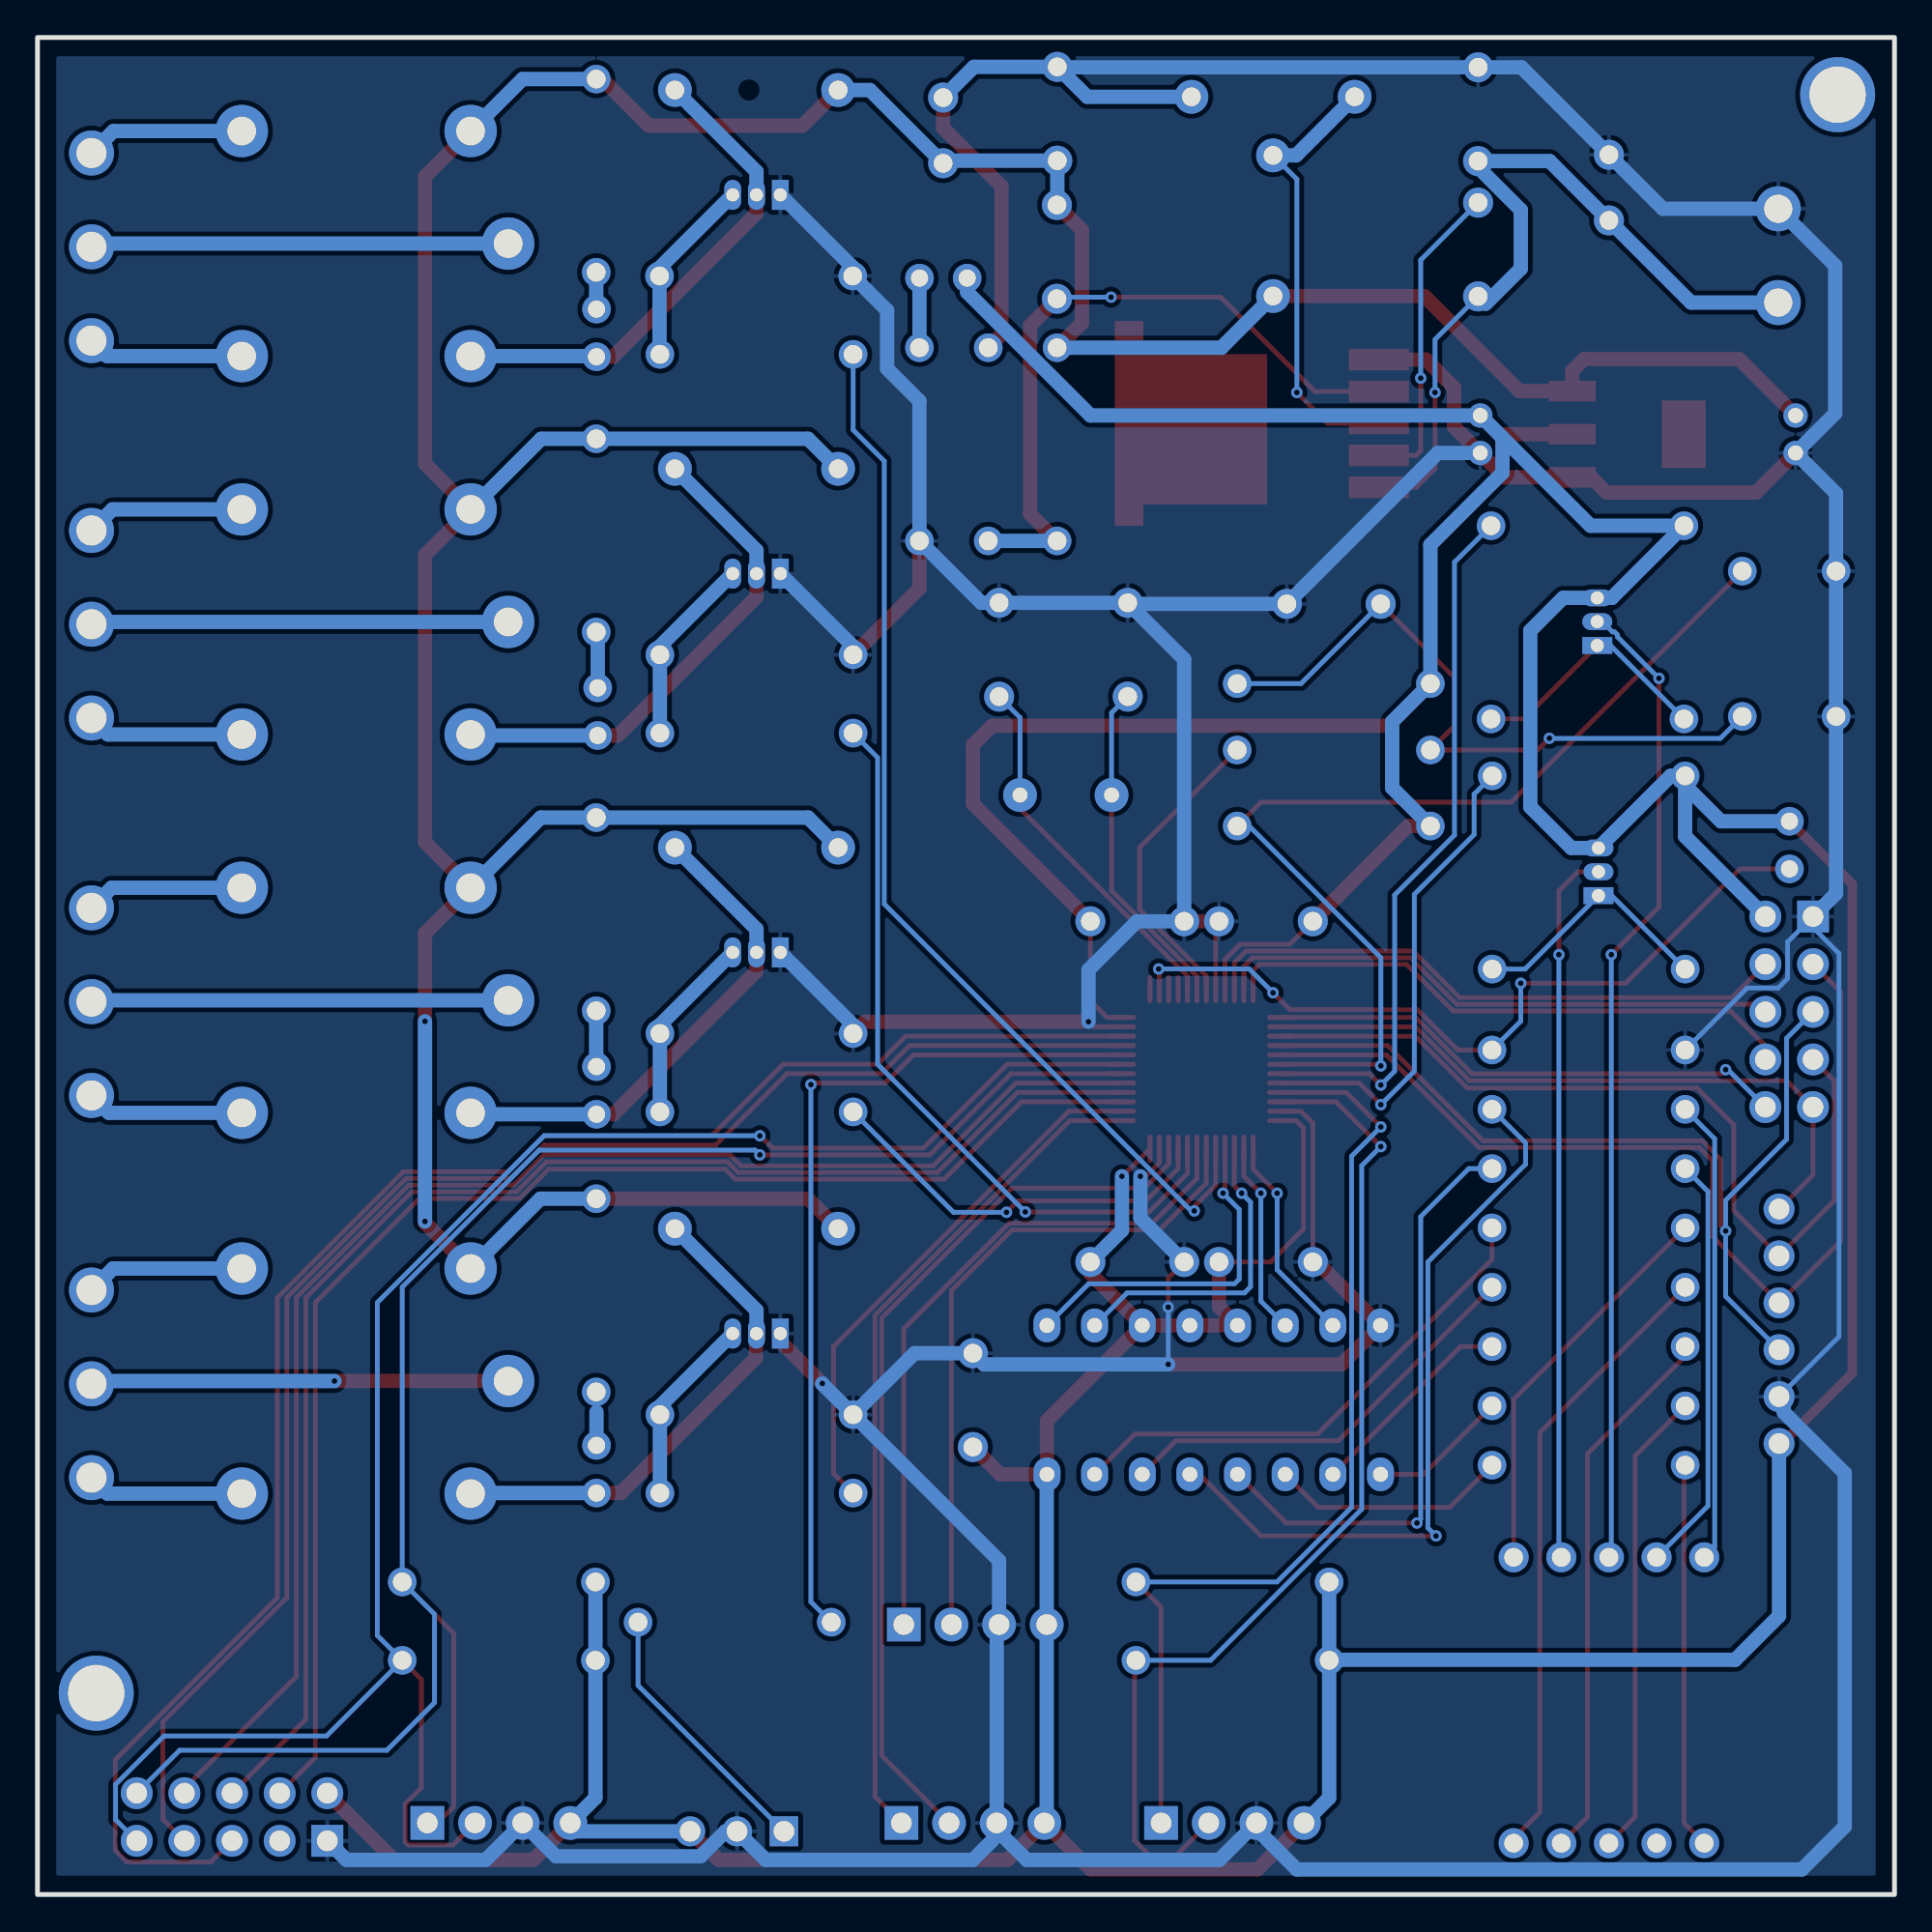
[diagram p4: board, bottom side, seen from below]

Outline 99 x 99 mm; copper layers: Top Layer, Bottom Layer. Coordinates in mm from the lower left corner of the outline.
Outline path: rectangle 0,99 99,0
Stack: Top Layer 0.035mm / Dielectric1 1.51mm FR4 er 4.5 / Bottom Layer 0.035mm

## Design rules (mm)
template: JLCPCB Capability(Two Layers Board)
spacing copperThickness1oz (default): track to track 0.102, other pairs 0.152 to 0.3
spacing copperThickness2oz: track to track 0.203, other pairs 0.152 to 0.3
track width copperThickness1oz (default): min 0.127, default 0.254, max 2.54
track width copperThickness2oz: min 0.203, default 0.254, max 2.54
differential pair differentialPair (default): width min 0.127, default 0.254, max 2.54; gap min 0.152, default 0.152
via viaSize (default): diameter min 0.5, default 0.61, max 10; hole min 0.3, default 0.305, max 6.3

## Placement (name value [footprint] x y rotation side)
C1  220uF 35V 8x12  [CAP-TH_BD8.0-P3.50-D0.5-FD]  15.22 91 90 top
C2  330uF  [CAP-TH_BD8.0-P3.50-D0.6-FD]  50.72 94.05 90 top
C3  10uF  [CAP-TH_BD5.0-P2.00-D0.8-FD]  5.27 77.85 270 top
C4  100nF  [CAP-TH_BD5.0-P2.00-D0.8-FD]  22.08 77.85 270 top
C11  100nF  [CAP-TH_L5.0-W2.5-P5.00-D1.0]  22.2 94.91 90 top
C12  100nF  [CAP-TH_L5.0-W2.5-P5.00-D1.0]  22.2 87.7 90 top
C13  100nF  [CAP-TH_L5.0-W2.5-P5.00-D1.0]  44.63 94.94 90 top
C14  33nF  [CAP-TH_L5.0-W2.5-P5.00-D1.0]  44.65 87.57 270 top
C15  100nF  [CAP-TH_L5.0-W2.5-P5.00-D1.0]  33.51 51.88 0 top
C16  100nF  [CAP-TH_L5.0-W2.5-P5.00-D1.0]  33.51 33.72 180 top
C17  100nF  [CAP-TH_L5.0-W2.5-P5.00-D1.0]  40.37 51.88 180 top
C18  100nF  [CAP-TH_L5.0-W2.5-P5.00-D1.0]  40.37 33.72 180 top
C19  100nF  [CAP-TH_L5.0-W2.5-P5.00-D1.0]  29.89 68.81 0 top
C21  22pF  [CAP-TH_L5.0-W2.5-P5.00-D1.0]  47.74 66.36 270 top
C22  22pF  [CAP-TH_L5.0-W2.5-P5.00-D1.0]  40.88 66.36 270 top
C23  100nF  [CAP-TH_L5.0-W2.5-P5.00-D1.0]  49.13 26.36 90 top
CN1  SWD  [CONN-TH_4P-P2.54-XH2.54-LI-4P]  49.13 3.81 180 top
CN2  UART1  [CONN-TH_4P-P2.54-XH2.54-LI-4P]  49.01 14.39 180 top
CN3  BOOT0  [CONN-TH_3P-P2.50_3PIN]  61.71 3.37 0 top
CN4  I2C1  [CONN-TH_4P-P2.54-XH2.54-LI-4P]  74.41 3.81 180 top
CN5  I2C2  [CONN-TH_4P-P2.54-XH2.54-LI-4P]  35.29 3.81 180 top
CN6  SPI1  [CONN-TH_XH2.54-6P]  6.16 30.29 270 top
CN7  GPIO A  [HDR-TH_10P-P2.54-V-M-R2-C5-S2.54]  5.61 47.06 270 top
CN8  GPIO B  [HDR-TH_10P-P2.54-V-M-R2-C5-S2.54]  88.63 4.13 0 top
D1  1N4736A  [DO-41_BD2.4-L4.7-P8.70-D0.9-RD]  33.13 95.84 0 top
D2  -  [DO-41_BD2.4-L4.7-P8.70-D0.9-RD]  60.67 96.2 0 top
D3  -  [DO-41_BD2.4-L4.7-P8.70-D0.9-RD]  60.67 76.01 0 top
D4  -  [DO-41_BD2.4-L4.7-P8.70-D0.9-RD]  60.67 55.81 0 top
D5  -  [DO-41_BD2.4-L4.7-P8.70-D0.9-RD]  60.67 35.49 0 top
GND  KF126-5.0-2P  [CONN-TH_P5.00_KF126-5.0-2P]  6.2 87.37 270 top
L1  47uH  [IND-TH_L14.5-W7.0-P7.0-D0.6_XR5026T470MVL7]  33.13 88.97 270 top
LED1  -  [LED_TH-3mm]  50.71 86.17 0 top
LED2  -  [LED_TH-3mm]  5.6 55.95 270 top
LED3  SN450561N  [LED-SEG-TH_10P-L25.0-W19.0-P2.54-S15.24-BL]  15.22 10.35 0 top
LED4  -  [LED_TH-3mm]  69.2 83.25 270 top
LED5  -  [LED_TH-3mm]  69.13 63.06 270 top
LED6  -  [LED_TH-3mm]  69.2 42.87 270 top
LED7  -  [LED_TH-3mm]  69.2 22.67 270 top
NOREF  -  [Pad_e70]  3.03 95.95 0 top
NOREF#2  -  [Pad_e72]  95.87 10.74 0 top
Q1  2SA1015-GR  [TO-92-3_L4.9-W3.7-P1.27-R]  15.85 67.86 270 top
Q2  2SA1015-GR  [TO-92-3_L4.9-W3.7-P1.27-R]  15.78 54.52 270 top
Q3  2SC1815G  [TO-92-3_L5.1-W4.1-P1.27-L]  60.67 90.61 0 top
Q4  2SC1815G  [TO-92-3_L5.1-W4.1-P1.27-L]  60.67 70.42 0 top
Q5  2SC1815G  [TO-92-3_L5.1-W4.1-P1.27-L]  60.67 50.23 0 top
Q6  2SC1815G  [TO-92-3_L5.1-W4.1-P1.27-L]  60.67 29.91 0 top
R1  10kΩ  [Res_1/4W]  44.64 77.31 90 top
R2  3.3kΩ  [Res_1/4W]  48.31 77.31 270 top
R3  330Ω  [Res_1/4W]  51.98 77.31 90 top
R4  10kΩ  [Res_1/4W]  29.89 64.56 180 top
R5  330Ω  [Res_1/4W]  29.89 61.01 0 top
R6  10kΩ  [Res_1/4W]  29.89 56.96 180 top
R7  330Ω  [Res_1/4W]  16.31 45.02 0 top
R8  10kΩ  [Res_1/4W]  61.83 14.52 0 top
R9  10kΩ  [Res_1/4W]  74.41 16.66 180 top
R10  10kΩ  [Res_1/4W]  74.41 12.48 180 top
R11  10kΩ  [Res_1/4W]  35.29 16.66 180 top
R12  10kΩ  [Res_1/4W]  35.29 12.48 180 top
R13  220Ω  [Res_1/4W]  16.31 35.54 0 top
R14  220Ω  [Res_1/4W]  16.31 32.37 0 top
R15  220Ω  [Res_1/4W]  16.31 41.86 0 top
R16  220Ω  [Res_1/4W]  16.31 38.7 0 top
R17  220Ω  [Res_1/4W]  16.31 22.89 0 top
R18  220Ω  [Res_1/4W]  16.31 29.21 0 top
R19  220Ω  [Res_1/4W]  16.31 26.05 0 top
R20  1kΩ  [Res_1/4W]  21.51 67.82 270 top
R21  10kΩ  [Res_1/4W]  11.22 67.82 90 top
R22  1kΩ  [Res_1/4W]  21.45 54.49 270 top
R23  10kΩ  [Res_1/4W]  11.16 54.49 90 top
R24  1kΩ  [Res_1/4W]  60.67 82.11 0 top
R25  10kΩ  [Res_1/4W]  60.69 86.29 180 top
R26  330Ω  [Res_1/4W]  69.21 91.63 90 top
R27  1kΩ  [Res_1/4W]  60.67 61.92 0 top
R28  10kΩ  [Res_1/4W]  60.67 66.09 180 top
R29  330Ω  [Res_1/4W]  69.21 72.46 90 top
R30  1kΩ  [Res_1/4W]  60.67 41.72 0 top
R31  10kΩ  [Res_1/4W]  60.67 45.9 180 top
R32  330Ω  [Res_1/4W]  69.21 52.26 90 top
R33  1kΩ  [Res_1/4W]  60.67 21.4 0 top
R34  10kΩ  [Res_1/4W]  60.67 25.58 180 top
R35  330Ω  [Res_1/4W]  69.21 31.94 90 top
RESET  KH-6X6X7.3H-Z2J  [KEY-TH_L6.2-W6.2-P5.00]  5.61 62.81 0 top
RLY1  SRD-05VDC-SL-C  [RELAY-TH_SRD-XXVDC-XL-C]  81.01 88.02 0 top
RLY2  SRD-05VDC-SL-C  [RELAY-TH_SRD-XXVDC-XL-C]  81.01 67.84 0 top
RLY3  SRD-05VDC-SL-C  [RELAY-TH_SRD-XXVDC-XL-C]  81.01 47.67 0 top
RLY4  SRD-05VDC-SL-C  [RELAY-TH_SRD-XXVDC-XL-C]  81.01 27.37 0 top
SW  KH-6X6X7.3H-Z2J  [KEY-TH_L6.2-W6.2-P5.00]  5.61 70.55 0 top
U2  XL4015E1  [TO-263-5_L10.2-W8.9-P1.70-TL]  32.5 78.43 0 top
U3  LM1117S-ADJ  [SOT-223-3_L6.5-W3.4-P2.30-LS7.0-BR]  14.21 77.85 0 top
U4  STM32F103C8T6  [LQFP-48_L7.0-W7.0-P0.50-LS9.0-BL]  36.94 44.01 180 top
U5  SN74HC47N(XBLW)  [PDIP-16_L19.3-W6.4-P2.54-LS7.94-BL]  36.29 26.37 180 top
U6  KF126-5.0-3P  [CONN-TH_3P-P5.00_KF126-5.0-3P]  96.12 87.84 90 top
U7  KF126-5.0-3P  [CONN-TH_3P-P5.00_KF126-5.0-3P]  96.12 67.72 90 top
U8  KF126-5.0-3P  [CONN-TH_3P-P5.00_KF126-5.0-3P]  96.12 47.6 90 top
U9  KF126-5.0-3P  [CONN-TH_3P-P5.00_KF126-5.0-3P]  96.12 27.22 90 top
X1  8MHz  [HC-49US_L11.0-W4.6-P4.88]  44.18 58.61 0 top

## Footprints (pads in the part's own frame, mm; a bottom-side part is the same pattern mirrored in y, then rotated)
CAP-TH_BD5.0-P2.00-D0.8-FD
  round 1.3 hole 0.8: 1(-1,0) 2(1,0)
CAP-TH_BD8.0-P3.50-D0.5-FD
  round 1.6 hole 1: 1(-1.75,0) 2(1.75,0)
CAP-TH_BD8.0-P3.50-D0.6-FD
  round 1.6 hole 1: 1(-1.75,0) 2(1.75,0)
CAP-TH_L5.0-W2.5-P5.00-D1.0
  round 1.6 hole 1: 1(-2.5,0) 2(2.5,0)
CONN-TH_3P-P2.50_3PIN
  rect 1.524x1.6 hole 1.1: 1(-2.5,0)
  round 1.6 hole 1.1: 2(0,0) 3(2.5,0)
CONN-TH_3P-P5.00_KF126-5.0-3P
  round 2.4 hole 1.6: 1(-5,0) 2(0,0) 3(5,0)
CONN-TH_4P-P2.54-XH2.54-LI-4P
  rect 1.8x1.8 hole 1.1: 1(-3.81,0)
  round 1.8 hole 1.1: 2(-1.27,0) 3(1.27,0) 4(3.81,0)
CONN-TH_P5.00_KF126-5.0-2P
  round 2.4 hole 1.5: 1(-2.5,0) 2(2.5,0)
CONN-TH_XH2.54-6P
  round 1.65 hole 1.1: 1(-6.25,0) 2(-3.75,0) 3(-1.25,0) 4(1.25,0) 5(3.75,0) 6(6.25,0)
DO-41_BD2.4-L4.7-P8.70-D0.9-RD
  round 1.8 hole 1: 1(-4.35,0) 2(4.35,0)
HC-49US_L11.0-W4.6-P4.88
  round 1.8 hole 0.8: 1(-2.44,0) 2(2.44,0)
HDR-TH_10P-P2.54-V-M-R2-C5-S2.54
  rect 1.7x1.7 hole 1.1: 1(-5.08,-1.27)
  round 1.7 hole 1.1: 2(-5.08,1.27) 3(-2.54,-1.27) 4(-2.54,1.27) 5(0,-1.27) 6(0,1.27) 7(2.54,-1.27) 8(2.54,1.27) 9(5.08,-1.27) 10(5.08,1.27)
IND-TH_L14.5-W7.0-P7.0-D0.6_XR5026T470MVL7
  round 1.8 hole 1: 1(-3.75,0) 2(3.75,0)
KEY-TH_L6.2-W6.2-P5.00
  round 1.524 hole 1: 1(-2.5,0) 2(2.5,0)
LED-SEG-TH_10P-L25.0-W19.0-P2.54-S15.24-BL
  round 1.6 hole 1: 1(-5.08,-7.62) 2(-2.54,-7.62) 3(0,-7.62) 4(2.54,-7.62) 5(5.08,-7.62) 6(5.08,7.62) 7(2.54,7.62) 8(0,7.62) 9(-2.54,7.62) 10(-5.08,7.62)
LED_TH-3mm
  round 1.524 hole 0.914: 1(-1.27,0) 2(1.27,0)
LQFP-48_L7.0-W7.0-P0.50-LS9.0-BL
  oval 0.27x1.5 smd: 1(-2.75,-4.25) 2(-2.25,-4.25) 3(-1.75,-4.25) 4(-1.25,-4.25) 5(-0.75,-4.25) 6(-0.25,-4.25) 7(0.25,-4.25) 8(0.75,-4.25) 9(1.25,-4.25) 10(1.75,-4.25) 11(2.25,-4.25) 12(2.75,-4.25) 25(2.75,4.25) 26(2.25,4.25) 27(1.75,4.25) 28(1.25,4.25) 29(0.75,4.25) 30(0.25,4.25) 31(-0.25,4.25) 32(-0.75,4.25) 33(-1.25,4.25) 34(-1.75,4.25) 35(-2.25,4.25) 36(-2.75,4.25)
  oval 1.5x0.27 smd: 13(4.25,-2.75) 14(4.25,-2.25) 15(4.25,-1.75) 16(4.25,-1.25) 17(4.25,-0.75) 18(4.25,-0.25) 19(4.25,0.25) 20(4.25,0.75) 21(4.25,1.25) 22(4.25,1.75) 23(4.25,2.25) 24(4.25,2.75) 37(-4.25,2.75) 38(-4.25,2.25) 39(-4.25,1.75) 40(-4.25,1.25) 41(-4.25,0.75) 42(-4.25,0.25) 43(-4.25,-0.25) 44(-4.25,-0.75) 45(-4.25,-1.25) 46(-4.25,-1.75) 47(-4.25,-2.25) 48(-4.25,-2.75)
Pad_e70
  round 4 hole 3: 1(0,0)
Pad_e72
  round 4 hole 3: 1(0,0)
PDIP-16_L19.3-W6.4-P2.54-LS7.94-BL
  oval 1.44x1.8 hole 0.8: 1(-8.89,-3.97) 2(-6.35,-3.97) 3(-3.81,-3.97) 4(-1.27,-3.97) 5(1.27,-3.97) 6(3.81,-3.97) 7(6.35,-3.97) 8(8.89,-3.97) 9(8.89,3.97) 10(6.35,3.97) 11(3.81,3.97) 12(1.27,3.97) 13(-1.27,3.97) 14(-3.81,3.97) 15(-6.35,3.97) 16(-8.89,3.97)
RELAY-TH_SRD-XXVDC-XL-C
  round 2.794 hole 1.524: 1(-5.1,-6) 2(7.1,-6) 3(7.1,6) 4(-5.1,6) 5(-7.1,0)
Res_1/4W
  round 1.524 hole 1: 1(-5.15,0) 2(5.15,0)
SOT-223-3_L6.5-W3.4-P2.30-LS7.0-BR
  rect 2.5x1.1 smd: 1(2.97,-2.3) 2(2.97,0) 3(2.97,2.3)
  rect 2.34x3.6 smd: 4(-2.97,0)
TO-92-3_L4.9-W3.7-P1.27-R
  rect 0.9x1.6 hole 0.7: 1(1.27,0)
  oval 0.9x1.6 hole 0.7: 2(0,0) 3(-1.27,0)
TO-92-3_L5.1-W4.1-P1.27-L
  rect 0.9x1.6 hole 0.7: 1(-1.27,0)
  oval 0.9x1.6 hole 0.7: 2(0,0) 3(1.27,0)
TO-263-5_L10.2-W8.9-P1.70-TL
  rect 3.2x1.15 smd: 1(-5.008,3.404) 2(-5.008,1.702) 3(-5.008,0) 4(-5.008,-1.702) 5(-5.008,-3.404)
  custom 8.128x10.922 smd: 6(5.008,-0.318)

## Nets
As in the schematic, except:
GND: C1.2 C2.2 C3.2 C4.2 C11.2 C13.2 C15.2 C16.2 C17.2 C18.2 C19.2 C21.1 C22.1 C23.2 CN1.3 CN2.3 CN3.2 CN4.3 CN5.3 CN6.5 CN7.1 CN8.1 D1.2 GND.1 Q3.1 Q4.1 Q5.1 Q6.1 R2.1 R3.1 R7.1 R25.2 R28.2 R31.2 R34.2 RESET.1 SW.1 U2.1 U3.1 U4.8 U4.23 U4.35 U4.47 U5.8
LED: LED2.2 R7.2 U4.2

Pads without a net: CN8 3; LED3 2; NOREF 1; NOREF#2 1; U2 6; U3 4; U4 1 3 4

## Via types
v1: diameter 0.61, hole 0.305, Top Layer to Bottom Layer, 39 vias

## Routing (per net, layer and track width the routed paths; a pad name or vN(x,y) marks a point on that pad's centre or on a via; arc(x,y) is an arc through that point)
+3.3V: length 400.5
  Top Layer w0.254: U4.24 31.9,41.26 31.51,40.86 31.51,35.47 33.26,33.72 C16.1 ; C17.1 42.87,47.65 41.98,46.76 U4.48 ; C15.1 32.24,50.65 34.89,50.65 35.69,49.85 U4.9 ; U4.36 41.16,38.29 v1(41.19,38.29)
  Top Layer w0.508: LED2.1 2.25,53.87 2.25,27.79 6,24.04 CN6.6
  Top Layer w0.762: C4.1 21.08,77.85 U3.2 ; R6.2 25.93,56.96 C15.1 ; CN8.2 79.99,1.84 72.56,1.84 CN4.4 ; U5.3 45.18,25.26 U5.16 47.68,22.4 C23.1 ; U5.3 U5.4 U5.5 36.01,31.33 C16.1 ; U5.3 42.87,33.11 C18.1 ; CN5.4 33.96,1.34 42.85,1.34 CN1.4 47.29,1.84 62.68,1.84 CN3.3 ; R4.2 26.99,62.31 48.11,62.31 49.13,61.28 49.13,58.15 C17.1
  Bottom Layer w0.762: R6.2 26.78,59 26.78,62.52 R4.2 24.74,71.96 20.9,75.8 20.9,77.67 ; R12.2 30.14,5.15 CN5.4 ; R12.2 R11.2 ; R12.2 30.11,12.51 8.49,12.51 6.16,14.85 CN6.6 ; LED1.1 49.44,85.43 42.86,78.85 C4.1 20.9,77.67 ; v1(41.19,38.29) 41.19,35.41 C18.1 ; 11.16,59.12 R23.2 11.94,59.64 Q2.3 17.23,55.79 19.41,57.98 19.41,67.38 17.67,69.13 Q1.3 15.07,69.13 R21.2 16.2,72.97 20.9,77.67 ; 11.16,59.12 11.16,56.41 6.88,52.14 ; 11.16,59.12 9.25,57.22 LED2.1 ; U5.16 45.2,22.39 CN2.4 45.2,3.94 CN1.4 ; R9.2 R10.2 69.26,5.15 CN4.4 70.15,3.37 CN3.3
+5V: length 224.3
  Top Layer w0.762: R26.2 68.89,96.78 66.4,94.3 58.22,94.3 D2.1 ; v1(78.34,35.88) 78.34,35.81 75.91,33.37 ; C3.1 8.28,81.86 16.55,81.86 17.18,81.23 U3.3 20,80.15 25.06,85.22 L1.2 ; 75.91,94.02 78.34,91.58 78.34,76.28 75.91,73.84 78.34,71.41 78.34,56.1 75.91,53.67 78.34,51.24 v1(78.34,46.55) ; C14.1 43.32,88.74 43.32,83.79 R1.2 ; D5.1 57.92,37.09 R35.2
  Bottom Layer w0.762: 75.91,94.02 73.14,96.78 R26.2 ; C14.1 44.63,90.09 C13.1 50.58,92.44 C2.1 54.62,96.2 D2.1 ; R35.2 72.19,37.09 75.91,33.37 ; v1(78.34,35.88) v1(78.34,46.55) ; 75.91,73.84 72.15,77.61 R29.2 57.92,77.61 D3.1 ; R1.2 35.89,82.46 L1.2 ; D4.1 57.92,57.41 R32.2 72.17,57.41 75.91,53.67
GND: length 503
  Top Layer w0.254: v1(42.97,46.53) 42.7,46.26 U4.47 ; C18.2 38.72,32.87 v1(38.72,31.31) ; v1(40.2,38.29) 39.91,38.29 39.19,39 U4.35 ; C15.2 36.19,51.7 U4.8 ; C16.2 31.01,34.98 31.01,34.99 31.01,41.12 31.64,41.76 U4.23
  Top Layer w0.762: R31.2 54.89,46.53 v1(42.97,46.53) ; R3.1 51.98,69.63 R28.2 ; C16.2 30.79,33.72 U5.8 29.48,28.26 v1(38.72,28.26) ; Q6.1 59.4,29.49 57.17,27.26 ; C2.2 50.72,94.18 47.61,91.07 47.61,83.17 R2.1 ; U2.1 24.98,81.83 23.48,80.33 23.48,78.25 C4.2 20.78,75.55 U3.1 16.16,75.55 15.35,74.74 7.38,74.74 C3.2 ; C17.2 C15.2
  Bottom Layer w0.254: R7.1 7.85,48.33 6.21,48.33 5.7,48.84 5.7,50.78 CN7.1 4.34,51.55 2.96,50.17 2.96,29.74 CN6.5 ; v1(38.72,31.31) v1(38.72,28.26)
  Bottom Layer w0.762: C18.2 40.2,36.06 v1(40.2,38.29) ; C4.2 24.35,76.85 C19.2 40.82,68.81 ; R28.2 55.52,66.54 Q4.1 ; R34.2 57.16,27.22 v1(57.16,27.25) ; R34.2 52.24,28.86 C23.2 48.54,28.26 v1(38.72,28.26) ; R34.2 47.74,17.8 47.74,14.39 47.86,14.26 CN1.3 ; v1(42.97,46.53) 42.97,49.29 40.38,51.88 C17.2 37.87,65.85 40.82,68.81 ; 44.61,97.41 43.04,95.84 D1.2 ; 44.61,97.41 C13.2 49.08,97.44 C2.2 ; 44.61,97.41 C11.2 19.89,97.41 C1.2 12.34,89.87 GND.1 3.16,86.83 3.16,78.96 C3.2 3.11,74.69 SW.1 RESET.1 3.11,53.37 CN7.1 ; Q5.1 55.52,46.34 R31.2 ; 40.82,68.81 C22.1 C21.1 48.68,68.86 R3.1 51.98,79.63 53.7,81.35 53.7,84.45 55.54,86.29 55.54,86.75 Q3.1 ; 47.7,3.28 47.51,3.46 ; 47.7,3.28 49.13,1.84 60.18,1.84 CN3.2 62.32,3.37 63.65,2.03 71.36,2.03 CN4.3 75.1,1.84 82.53,1.84 CN8.1 ; 47.7,3.28 46.26,1.84 35.99,1.84 CN5.3 34.02,3.5 31.86,1.34 4.94,1.34 2.65,3.62 2.65,22.46 5.9,25.71 5.9,26.29 CN6.5
A: length 24.8
  Bottom Layer w0.254: R15.1 9.58,40.28 9.58,18.53 10.14,17.97
B: length 22.4
  Bottom Layer w0.254: R16.1 9.94,37.48 9.94,20.72 12.68,17.97
BOOT0: length 46.3
  Top Layer w0.254: U4.44 52.3,44.76 53.8,43.26 57.68,43.26 v1(57.77,43.18)
  Bottom Layer w0.254: R8.1 57.77,15.6 v1(57.77,43.18)
BTN: length 54.3
  Top Layer w0.254: U4.18 27.44,44.26 27.35,44.18 ; R6.1 33.77,58.23 20.43,58.23 SW.2
  Bottom Layer w0.254: R6.1 34.4,56.96 27.38,49.94 v1(27.38,44.18)
C: length 20.6
  Top Layer w0.254: LED3.1 11.22,3.81 11.22,22.82 R17.1
CLK1: length 19.8
  Top Layer w0.254: X1.2 46.62,57.89 37.69,48.96 U4.5
  Bottom Layer w0.254: X1.2 46.62,62.75 C21.2
CLK2: length 17.8
  Top Layer w0.254: X1.1 41.74,53.51 37.19,48.96 U4.6
  Bottom Layer w0.254: X1.1 41.74,63 C22.2
D: length 29.2
  Top Layer w0.254: R18.1 11.16,28.7 16.37,23.5 16.37,4.13 LED3.4
D1: length 37.8
  Top Layer w0.254: v1(27.38,43.15) 27.99,43.76 U4.19
  Bottom Layer w0.254: v1(27.38,43.15) 26.65,43.89 26.65,53.29 23.46,56.48 23.46,71.03 R20.1
D2: length 25.8
  Top Layer w0.254: U4.20 28.54,43.26 v1(27.38,42.11)
  Bottom Layer w0.254: R22.1 21.45,59.63 22.41,58.66 22.41,56.51 25.6,53.32 25.6,43.89 v1(27.38,42.11)
DIG1: length 52.6
  Top Layer w0.254: v1(12.56,64.84) 12.56,52.64 v1(15.1,50.11)
  Bottom Layer w0.254: 15.22,17.97 15.1,18.1 v1(15.1,50.11) ; Q1.2 15.58,67.86 15.03,67.31 14.93,67.31 14.77,67.15 14.77,67.05 v1(12.56,64.84)
DIG2: length 38.1
  Top Layer w0.254: v1(17.89,50.11) 17.89,53.5 16.88,54.52 Q2.2
  Bottom Layer w0.254: v1(17.89,50.11) 17.89,18.1 17.76,17.97
E: length 25
  Top Layer w0.254: LED3.3 13.83,4.13 13.83,23.38 R19.1
F: length 21.3
  Top Layer w0.254: R13.1 20.3,26.39 20.3,17.97
G: length 33.4
  Top Layer w0.254: 20.3,2.73 20.3,2.99 18.91,4.38 18.91,24.63 R14.1
LED: length 41.7
  Top Layer w0.254: LED2.2 8.24,54.68 14.33,48.58 v1(19.92,48.58) ; v1(39.23,49.34) 39.19,49.31 U4.2 ; 21.46,45.02 23.29,45.02 25.44,47.17 32.23,47.17 v1(33.13,48.07)
  Bottom Layer w0.254: 21.46,45.02 19.92,46.56 v1(19.92,48.58) ; v1(39.23,49.34) 34.4,49.34 v1(33.13,48.07)
NSRT: length 16.4
  Top Layer w0.254: R5.2 40.24,55.81 40.24,52.52 36.69,48.97 U4.7
PA0: length 31.7
  Top Layer w0.254: 6.88,49.6 8.67,47.81 23.18,47.81 25.66,50.3 34.57,50.3 35.19,49.68 U4.10
PA1: length 30.4
  Top Layer w0.254: 6.88,47.06 7.29,47.46 7.98,47.46 7.99,47.46 23.33,47.46 25.81,49.94 34.22,49.94 34.69,49.47 U4.11
PA2: length 31
  Top Layer w0.254: U4.12 34.19,49.26 33.87,49.59 26.01,49.59 23.52,47.1 8.75,47.1 6.88,45.24 6.88,44.52
PA3: length 28
  Top Layer w0.254: U4.13 25.53,46.76 22.52,43.75 9.22,43.75 v1(9,43.97)
  Bottom Layer w0.254: 6.88,41.98 8.88,43.97 v1(9,43.97)
PA4: length 36.3
  Top Layer w0.254: U4.14 25.53,46.26 22.66,43.39 5.75,43.39 CN7.9 4.34,38.35 CN6.1
PA5: length 46.2
  Top Layer w0.254: CN7.7 3.21,43.39 3.21,36.98 CN6.2 8.57,36.46 8.57,41.04 10.52,42.99 22.77,42.99 25.53,45.76 U4.15
PA6: length 51
  Top Layer w0.254: v1(9,35.37) 9.25,35.63 9.25,39.18 10.25,40.18 21.94,40.18 27.02,45.26 U4.16
  Bottom Layer w0.254: CN6.4 9,31.89 v1(9,35.37) 9,37.01 5.75,40.26 5.75,45.65 CN7.5
PA7: length 54.4
  Top Layer w0.254: CN7.3 2.86,48.11 2.86,34.84 CN6.3 9.69,35.08 9.69,39.11 10.41,39.83 22.15,39.83 27.09,44.76 U4.17
PA9: length 35.6
  Top Layer w0.254: CN2.2 50.28,32.2 47.04,35.43 39.17,35.43 36.69,37.91 U4.30
PA10: length 36.3
  Top Layer w0.254: U4.31 37.19,38.17 39.58,35.79 47.2,35.79 52.82,30.17 CN2.1
PA13: length 47.9
  Top Layer w0.254: CN1.2 53.99,7.41 53.99,30.73 47.06,37.66 39.99,37.66 38.69,38.96 U4.34
PA14: length 45.1
  Top Layer w0.254: U4.37 43.97,41.26 54.35,30.87 54.35,5.22 CN1.1
PB3: length 74.8
  Top Layer w0.254: U4.39 46.55,42.26 50.67,38.14 61.8,38.14 62.34,38.67 71.74,38.67 73.31,37.11 78.64,37.11 84.18,31.56 84.18,7.31 86.09,5.4
PB4: length 76.6
  Top Layer w0.254: U4.40 46.75,42.76 51.02,38.49 61.64,38.49 62.21,39.06 71.86,39.06 73.46,37.46 79.05,37.46 84.69,31.82 84.69,9.34 CN8.6
PB5: length 78.1
  Top Layer w0.254: CN8.8 91.17,5.66 85.2,11.62 85.2,31.82 79.2,37.82 73.61,37.82 71.99,39.44 62.09,39.44 61.5,38.85 51.25,38.85 46.83,43.26 U4.41
PB6: length 98.9
  Top Layer w0.254: U4.42 47.1,43.76 51.43,39.43 v1(60.49,39.43) ; CN4.1 77.67,3.81 76.81,4.68 76.81,13.92 R9.1
  Bottom Layer w0.254: 93.71,5.4 91.42,7.69 80.37,7.69 77.83,10.23 77.83,14.94 R9.1 79.56,32.38 72.25,39.69 60.74,39.69 v1(60.49,39.43)
PB7: length 101.4
  Top Layer w0.254: v1(60.49,40.45) 60.45,40.45 59.8,39.79 51.77,39.79 47.31,44.26 U4.43 ; R10.1 78.54,11.47 78.54,5.68 79.39,4.83 79.39,2.8 79.23,2.63 76.86,2.63 CN4.2
  Bottom Layer w0.254: v1(60.49,40.45) 60.5,40.45 71.99,40.45 80.88,31.56 80.88,13.81 R10.1 83.59,8.45 92.26,8.45 94.84,5.87 94.84,3.99 93.71,2.86
PB8: length 82.3
  Top Layer w0.254: U4.45 52.51,45.26 54.01,43.76 59.04,43.76 62.85,39.95 71.98,39.95 73.76,38.17 79.35,38.17 85.71,31.82 85.71,15.82 92.31,9.22 92.31,4 CN8.7
PB9: length 90.8
  Top Layer w0.254: CN8.5 89.76,1.73 94.23,1.73 94.85,2.35 94.85,7.18 86.22,15.81 86.22,31.82 79.5,38.53 73.92,38.53 71.99,40.45 63.06,40.45 59.25,44.26 54.21,44.26 52.72,45.76 U4.46
PB10: length 53.5
  Top Layer w0.254: R11.1 39.1,15.32 CN5.1 ; v1(27.38,40.92) 29.22,42.76 U4.21
  Bottom Layer w0.254: v1(27.38,40.92) 28.94,39.36 28.94,20.64 32.92,16.66 R11.1
PB11: length 56
  Top Layer w0.254: v1(27.38,39.87) 29.77,42.26 U4.22 ; CN5.2 38.27,2.1 39.73,2.1 40.51,2.88 40.51,12.41 R12.1
  Bottom Layer w0.254: R12.1 36.46,12.48 28.4,20.54 28.4,38.86 v1(27.38,39.87)
PB12: length 11.2
  Top Layer w0.254: v1(32.91,37.39) 34.19,38.66 U4.25
  Bottom Layer w0.254: U5.7 32.91,33.31 v1(32.91,37.39)
PB13: length 10.3
  Top Layer w0.254: v1(33.78,37.39) 34.69,38.3 U4.26
  Bottom Layer w0.254: U5.6 33.78,31.63 v1(33.78,37.39)
PB14: length 16.9
  Top Layer w0.254: v1(34.81,37.39) 35.19,37.77 U4.27
  Bottom Layer w0.254: v1(34.81,37.39) 34.33,36.91 34.33,32.4 34.65,32.07 40.91,32.07 U5.2
PB15: length 18.6
  Top Layer w0.254: U4.28 35.69,37.49 v1(35.8,37.39)
  Bottom Layer w0.254: v1(35.8,37.39) 34.93,36.52 34.93,32.81 35.19,32.56 42.97,32.56 U5.1
RLY1: length 57.1
  Top Layer w0.254: v1(37.33,36.44) 37.33,36.68 36.19,37.82 U4.29
  Bottom Layer w0.254: R24.1 55.52,78.08 53.86,76.42 53.86,52.81 37.49,36.44 v1(37.33,36.44)
RLY2: length 40.2
  Top Layer w0.254: U4.32 37.69,38.43 39.73,36.39 v1(46.34,36.39)
  Bottom Layer w0.254: R27.1 54.21,60.61 54.21,44.26 v1(46.34,36.39)
RLY3: length 21.6
  Top Layer w0.254: v1(47.34,36.37) 46.74,36.97 39.91,36.97 38.19,38.7 U4.33
  Bottom Layer w0.254: R30.1 50.17,36.37 v1(47.34,36.37)
RLY4: length 28.8
  Top Layer w0.254: R33.1 56.56,22.44 56.56,29.22 44.02,41.76 U4.38
$1N1678: length 42
  Top Layer w0.254: v1(24.49,80.08) 24.49,76.01 25.49,75.02 U2.5
  Bottom Layer w0.254: v1(24.49,80.08) 24.49,82.9 C12.1
  Bottom Layer w0.762: 21.8,84.8 19.92,86.68 19.92,89.81 22.2,92.08 C11.1 18.39,92.41 C1.1 10.84,84.87 GND.2
$1N1723: length 16.8
  Top Layer w0.254: v1(25.26,80.84) 25.26,76.98 25.51,76.72 U2.4
  Bottom Layer w0.254: C12.2 25.26,87.14 v1(25.26,80.84)
$1N1863: length 23.9
  Top Layer w0.254: v1(31.86,80.08) 30.21,78.43 U2.3
  Bottom Layer w0.254: v1(31.86,80.08) 31.86,91.45 L1.1
  Bottom Layer w0.762: L1.1 31.9,92.72 D1.1
$1N1929: length 37.1
  Top Layer w0.254: U2.2 30.9,80.13 35.92,85.16 v1(41.77,85.16)
  Top Layer w0.762: R1.1 46.08,73.6 46.08,83.64 C14.2
  Bottom Layer w0.254: v1(41.77,85.16) 44.57,85.16 C14.2
  Bottom Layer w0.762: R2.2 R1.1
$1N2031: length 3.7
  Bottom Layer w0.762: LED1.2 51.98,82.47 R3.2
$2N1835: length 36.7
  Top Layer w0.254: C19.1 23.48,64.89 23.48,62.28 R5.1 19.02,61.01 v1(18.4,61.64)
  Bottom Layer w0.254: C19.1 31.64,64.56 R4.1 ; RESET.2 9.29,61.63 18.39,61.63 v1(18.4,61.64)
$2N3059: length 14.4
  Bottom Layer w0.254: R8.2 66.98,11.14 CN3.1
$2N7394: length 27.6
  Top Layer w0.254: 21.46,35.54 21.46,33.85 30.75,24.55 40.49,24.55 U5.15
$2N7423: length 22.8
  Top Layer w0.254: 21.46,32.37 29.64,24.2 38.3,24.2 U5.14
$2N7454: length 40.3
  Top Layer w0.254: U5.13 37.05,22.4 33.77,19.12 v1(24.44,19.12)
  Bottom Layer w0.254: v1(24.44,19.12) 24.88,19.55 24.88,33.72 19.67,38.93 19.67,40.07 21.46,41.86
$2N7483: length 31.9
  Top Layer w0.254: v1(25.46,19.8) 32.43,19.8 U5.12
  Bottom Layer w0.254: v1(25.46,19.8) 25.26,20.01 25.26,36.14 22.69,38.7 21.46,38.7
$2N7512: length 12.7
  Top Layer w0.254: 21.46,22.89 23.71,20.64 30.73,20.64 U5.11
$2N7541: length 11.3
  Top Layer w0.254: 21.46,29.21 23.13,29.21 U5.10
$2N7570: length 7.5
  Top Layer w0.254: U5.9 25.11,22.4 21.46,26.05
$2N7812: length 13.5
  Top Layer w0.254: Q1.1 19.76,62.67 R20.2
  Bottom Layer w0.254: Q1.1 15.14,66.59 R21.1
$2N8088: length 13.5
  Bottom Layer w0.254: R22.2 19.7,49.34 Q2.1 15.07,53.25 R23.1
$3N247: length 10.1
  Bottom Layer w0.762: R24.2 65.84,82.13 R25.1 65.84,86.71 Q3.3
$3N338: length 26.8
  Top Layer w0.762: Q3.2 60.67,89.63 68.31,81.98 LED4.2
  Bottom Layer w0.762: Q3.2 60.67,91.85 D2.2 ; LED4.2 69.23,82.02 75.91,82.02
$3N597: length 8.4
  Bottom Layer w0.762: RLY1.2 95.3,82.02 U6.1
$3N1771: length 22.3
  Bottom Layer w0.762: U6.2 95.95,88.02 73.91,88.02
$3N1927: length 8.5
  Bottom Layer w0.762: RLY1.3 94.95,94.01 U6.3
$3N4941: length 2
  Bottom Layer w0.762: LED4.1 69.21,84.54 69.21,86.48
$3N5260: length 10.1
  Bottom Layer w0.762: Q4.3 65.82,66.54 R28.1 R27.2
$3N5264: length 27
  Top Layer w0.762: LED5.2 68.06,61.79 60.67,69.18 Q4.2
  Bottom Layer w0.762: D3.2 60.67,71.66 Q4.2 ; 75.91,61.84 75.86,61.79 LED5.2
$3N5265: length 22.3
  Bottom Layer w0.762: 73.91,67.84 96,67.84 U7.2
$3N5266: length 8.4
  Bottom Layer w0.762: RLY2.2 95.25,61.84 U7.1
$3N5267: length 8.5
  Bottom Layer w0.762: RLY2.3 95,73.84 U7.3
$3N5269: length 3
  Bottom Layer w0.762: R29.1 69.13,67.23 LED5.1
$3N5860: length 22.2
  Bottom Layer w0.762: U8.2 96.05,47.67 73.91,47.67
$3N5861: length 8.4
  Bottom Layer w0.762: U8.1 95.2,41.67 RLY3.2
$3N5862: length 8.5
  Bottom Layer w0.762: U8.3 95.05,53.67 RLY3.3
$3N5863: length 26.8
  Top Layer w0.762: Q5.2 60.67,49.22 68.29,41.6 LED6.2
  Bottom Layer w0.762: LED6.2 75.83,41.6 75.91,41.67 ; D4.2 60.67,51.46 Q5.2
$3N5864: length 3
  Bottom Layer w0.762: R32.1 69.21,44.15 LED6.1
$3N5866: length 26.9
  Top Layer w0.762: Q6.2 60.67,29.65 60.7,29.62 60.7,28.61 67.91,21.4 LED7.2
  Bottom Layer w0.762: 75.91,21.37 75.88,21.4 LED7.2 ; Q6.2 60.67,31.14 D5.2
$3N5867: length 1.8
  Bottom Layer w0.762: 69.2,25.72 LED7.1
$3N5871: length 10.1
  Bottom Layer w0.762: Q5.3 65.82,46.34 R31.1 R30.2
$3N5875: length 22.3
  Top Layer w0.762: 73.91,27.37 v1(83.17,27.37)
  Bottom Layer w0.762: v1(83.17,27.37) 95.98,27.37 U9.2
$3N5876: length 8.4
  Bottom Layer w0.762: U9.1 95.27,21.37 RLY4.2
$3N5877: length 8.5
  Bottom Layer w0.762: U9.3 94.98,33.37 RLY4.3
$3N5878: length 10.1
  Bottom Layer w0.762: Q6.3 65.82,26.03 R34.1 R33.2

## Copper pours and planes (outline as drawn; the poured copper is in the pictures)
GND on Top Layer: 1,98 98,98 98,1 1,1
GND on Bottom Layer: 24.37,91.65 121.37,91.65 121.37,-5.35 24.37,-5.35
GND on Bottom Layer: 1,98 98,98 98,1 1,1

## Text on the board
Document Layer: SBS
Top Silkscreen Layer: 5V | SBS
